# EAGLE design Laser_Teensy_proto (EAGLE 9.6.2)

## Sheet 1 of 3
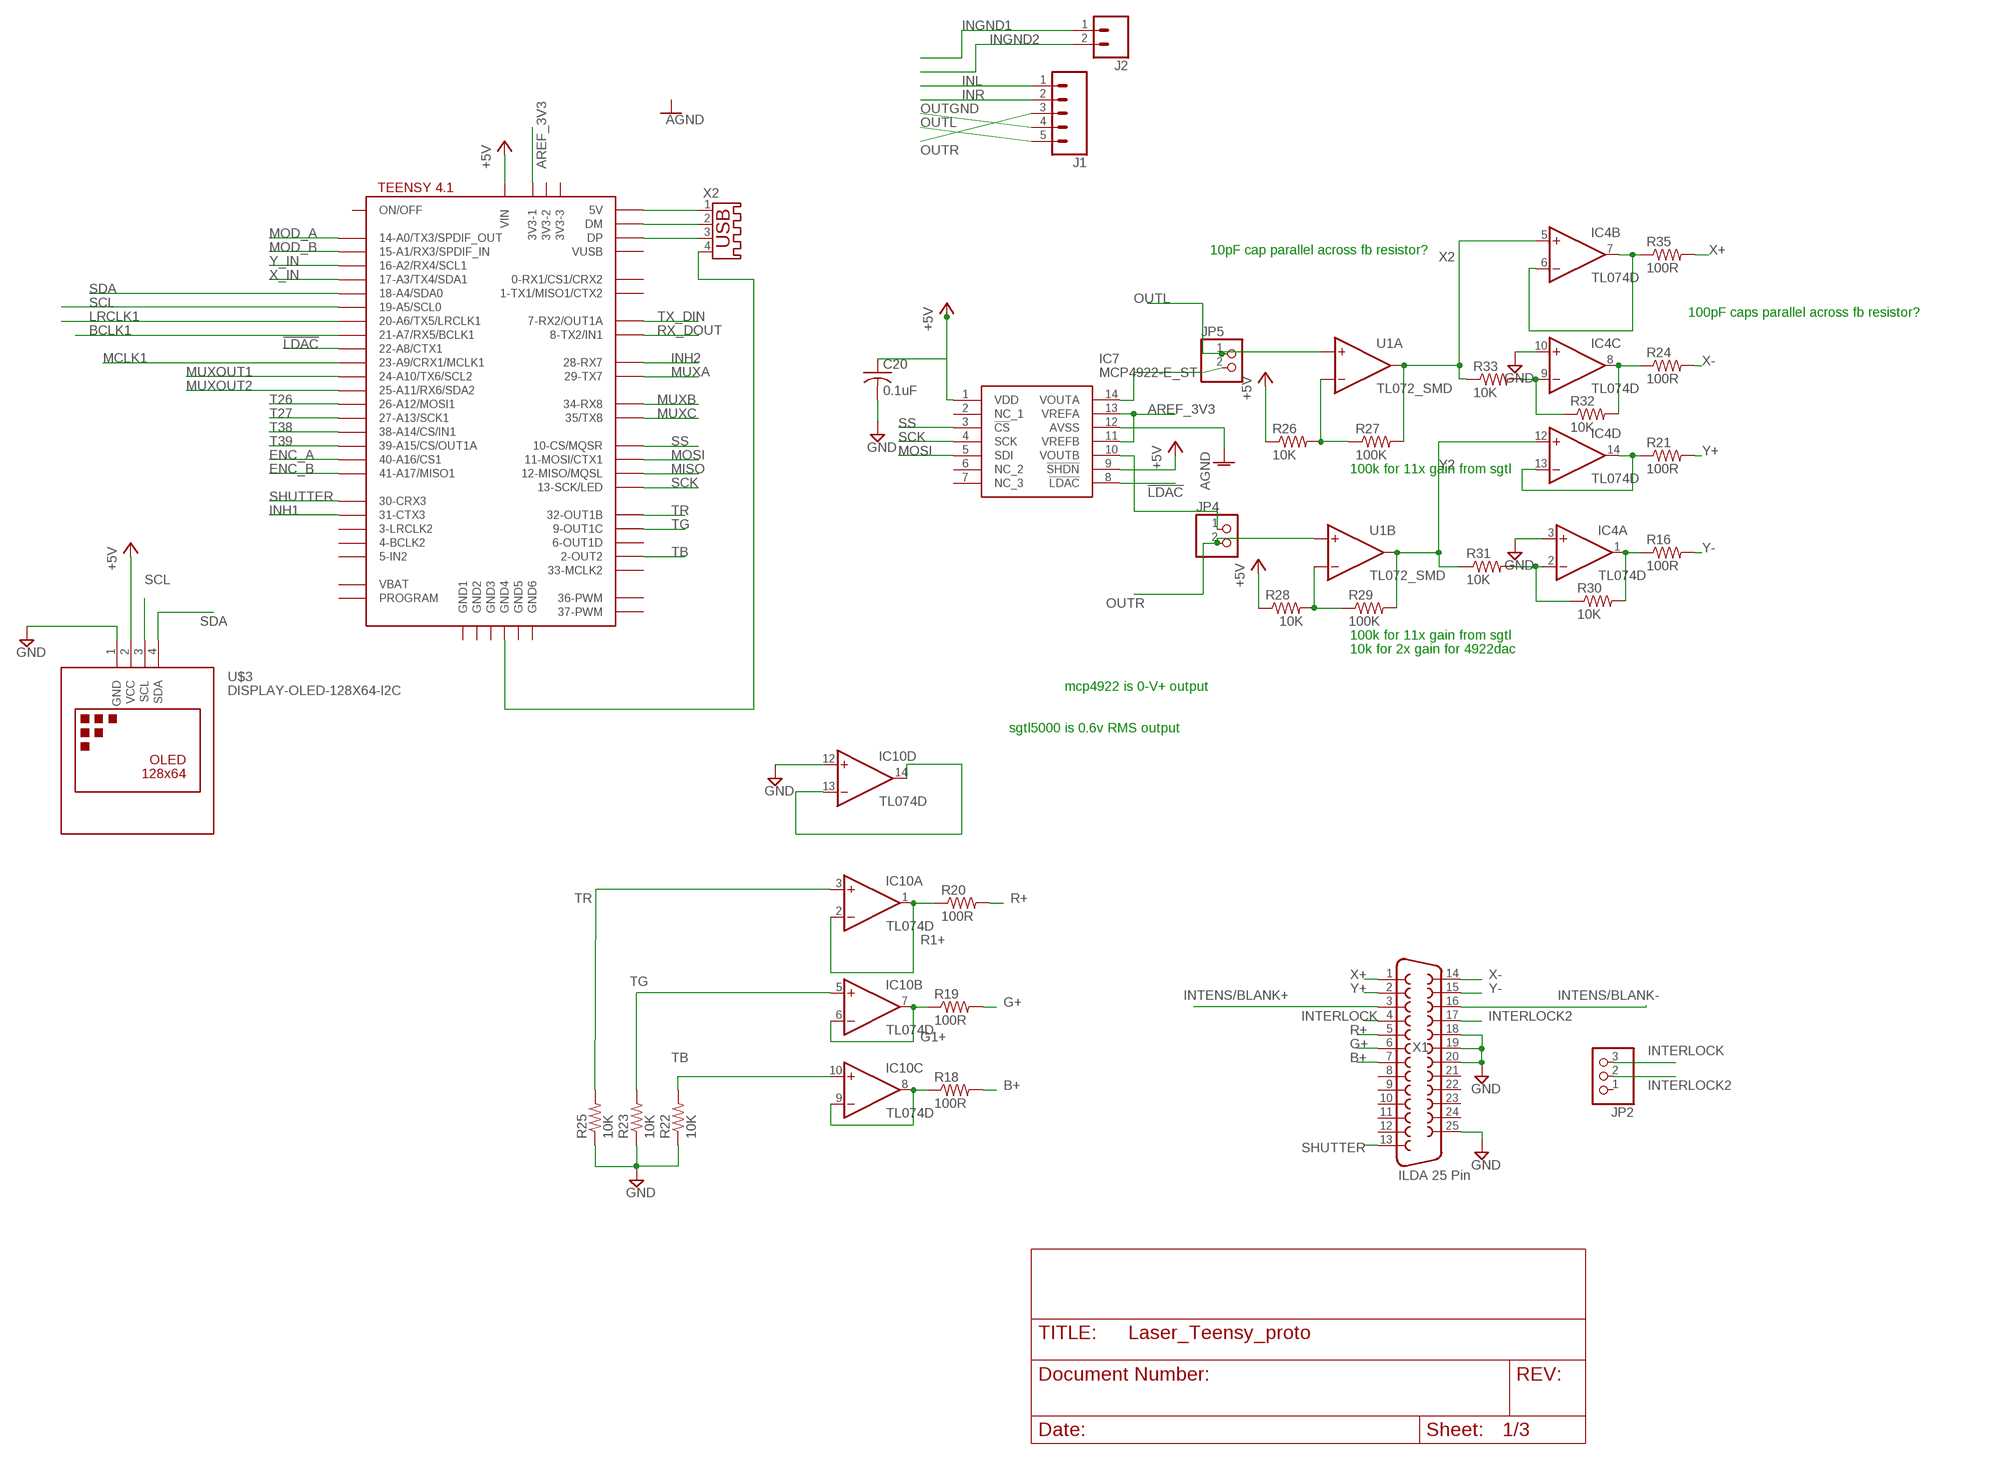
[diagram p0: schematic, sheet 1]

### Parts
C20  0.1uF  C-USC0603  [C0603]
IC4  TL074D  [SO14]
IC7  MCP4922-E_ST  [SOP65P638X110-14N]
IC10  TL074D  [SO14]
J1  CONN_05  [1X05]
J2  CONN_02  [1X02]
JP2  PINHD-1X3  [1X03]
JP4  PINHD-1X2  [1X02]
JP5  PINHD-1X2  [1X02]
R16  100R  R-US_0204/5  [0204/5]
R18  100R  R-US_0204/5  [0204/5]
R19  100R  R-US_0204/5  [0204/5]
R20  100R  R-US_0204/5  [0204/5]
R21  100R  R-US_0204/5  [0204/5]
R22  10K  R-US_0204/5  [0204/5]
R23  10K  R-US_0204/5  [0204/5]
R24  100R  R-US_0204/5  [0204/5]
R25  10K  R-US_0204/5  [0204/5]
R26  10K  R-US_0204/5  [0204/5]
R27  100K  R-US_0204/5  [0204/5]
R28  10K  R-US_0204/5  [0204/5]
R29  100K  R-US_0204/5  [0204/5]
R30  10K  R-US_0204/5  [0204/5]
R31  10K  R-US_0204/5  [0204/5]
R32  10K  R-US_R0603  [R0603]
R33  10K  R-US_0204/5  [0204/5]
R35  100R  R-US_0204/5  [0204/5]
U1  TL072_SMD  [SO08]
U$2  TEENSY41-E  [TENNSY41-E]
U$3  DISPLAY-OLED-128X64-I2C  [DISPLAY-OLED-128X64-I2C]
X1  ILDA 25 Pin  F25D  [F25D]
X2  USB-A003  [USB-A003]

### Nets
!LDAC: IC7.8(!LDAC) U$2.22-A8/CTX1
+5V [power]: C20.1 IC7.1(VDD) IC7.9(!SHDN) R26.1 R28.1 U$2.VIN U$3.2(VCC) ; also sheet 2,3
AGND: IC7.12(AVSS)
AREF_3V3: IC7.11(VREFB) IC7.13(VREFA) U$2.3V3-1
B1+1: IC10.8(C:OUT) IC10.9(C:-IN) R18.1
B+: R18.2 X1.7
BCLK1: U$2.21-A7/RX5/BCLK1
ENC_A: U$2.40-A16/CS1 ; also sheet 2
ENC_B: U$2.41-A17/MISO1 ; also sheet 2
G1+: IC10.6(B:-IN) IC10.7(B:OUT) R19.1
G+: R19.2 X1.6
GND: C20.2 IC4.3(A:+IN) IC4.10(C:+IN) IC10.12(D:+IN) R22.1 R23.1 R25.1 U$3.1(GND) X1.18 X1.19 X1.20 X1.25 ; also sheet 2,3
INGND1: J2.1
INGND2: J2.2
INH1: U$2.31-CTX3 ; also sheet 2
INH2: U$2.28-RX7 ; also sheet 2
INL: J1.1
INR: J1.2
INTENS/BLANK+: X1.3
INTENS/BLANK-: X1.16
INTERLOCK: JP2.3 X1.4
INTERLOCK2: JP2.2 X1.17
LRCLK1: U$2.20-A6/TX5/LRCLK1
MCLK1: U$2.23-A9/CRX1/MCLK1
MISO: U$2.12-MISO/MQSL
MOD_A: U$2.14-A0/TX3/SPDIF_OUT ; also sheet 2
MOD_B: U$2.15-A1/RX3/SPDIF_IN ; also sheet 2
MOSI: IC7.5(SDI) U$2.11-MOSI/CTX1
MUXA: U$2.29-TX7 ; also sheet 2
MUXB: U$2.34-RX8 ; also sheet 2
MUXC: U$2.35-TX8(35/TX8) ; also sheet 2
MUXOUT1: U$2.24-A10/TX6/SCL2 ; also sheet 2
MUXOUT2: U$2.25-A11/RX6/SDA2 ; also sheet 2
N$1: IC7.14(VOUTA) JP5.2
N$3: U$2.+5V(5V) X2.1
N$4: U$2.DM X2.2
N$5: U$2.DP X2.3
N$12: U$2.GND4 X2.4
N$13: IC10.13(D:-IN) IC10.14(D:OUT)
N$17: IC7.10(VOUTB) JP4.1
N$30: R26.2 R27.1 U1.2(A:-IN)
N$31: R28.2 R29.1 U1.6(B:-IN)
N$35: IC4.9(C:-IN) R32.1 R33.2
N$36: IC4.2(A:-IN) R30.1 R31.2
OUTGND: J1.4
OUTL: J1.5 JP5.1 U1.3(A:+IN)
OUTR: J1.3 JP4.2 U1.5(B:+IN)
R1+: IC10.1(A:OUT) IC10.2(A:-IN) R20.1
R+: R20.2 X1.5
RX_DOUT: U$2.8-TX2/IN1
SCK: IC7.4(SCK) U$2.13-SCK/LED
SCL: U$2.19-A5/SCL0 U$3.3(SCL)
SDA: U$2.18-A4/SDA0 U$3.4(SDA)
SHUTTER: U$2.30-CRX3 X1.13
SS: IC7.3(!CS) U$2.10-CS\MQSR(10-CS/MQSR)
T26: U$2.26-A12/MOSI1 ; also sheet 2
T27: U$2.27-A13/SCK1 ; also sheet 2
T38: U$2.38-A14/CS/IN1 ; also sheet 2
T39: U$2.39-A15/CS/OUT1A
TB: IC10.10(C:+IN) R22.2 U$2.2-OUT2
TG: IC10.5(B:+IN) R23.2 U$2.9-OUT1C
TR: IC10.3(A:+IN) R25.2 U$2.32-OUT1B
TX_DIN: U$2.7-RX2/OUT1A
X1+: IC4.6(B:-IN) IC4.7(B:OUT) R35.1
X1-: IC4.8(C:OUT) R24.1 R32.2
X2: IC4.5(B:+IN) R27.2 R33.1 U1.1(A:OUT)
X+: R35.2 X1.1
X-: R24.2 X1.14
X_IN: U$2.17-A3/TX4/SDA1 ; also sheet 2
Y1+: IC4.13(D:-IN) IC4.14(D:OUT) R21.1
Y1-: IC4.1(A:OUT) R16.1 R30.2
Y2: IC4.12(D:+IN) R29.2 R31.1 U1.7(B:OUT)
Y+: R21.2 X1.2
Y-: R16.2 X1.15
Y_IN: U$2.16-A2/RX4/SCL1 ; also sheet 2
Unconnected: IC7.2(NC_1) IC7.6(NC_2) IC7.7(NC_3) JP2.1 U$2.0-RX1/CS1/CRX2 U$2.1-TX1/MISO1/CTX2 U$2.3-LRCLK2 U$2.3V3-2 U$2.3V3-3 U$2.4-BCLK2 U$2.5-IN2 U$2.6-OUT1D U$2.33-MCLK2 U$2.36-PWM U$2.37-PWM U$2.GND1 U$2.GND2 U$2.GND3 U$2.GND5 U$2.GND6 U$2.ON/OFF U$2.PROGRAM U$2.VBAT U$2.VUSB X1.8 X1.9 X1.10 X1.11 X1.12 X1.21 X1.22 X1.23 X1.24

### Notes on the sheet
- 10pF cap parallel across fb resistor?
- 100pF caps parallel across fb resistor?
- 100k for 11x gain from sgtl
- 100k for 11x gain from sgtl
- 10k for 2x gain for 4922dac
- mcp4922 is 0-V+ output
- sgtl5000 is 0.6v RMS output

## Sheet 2 of 3
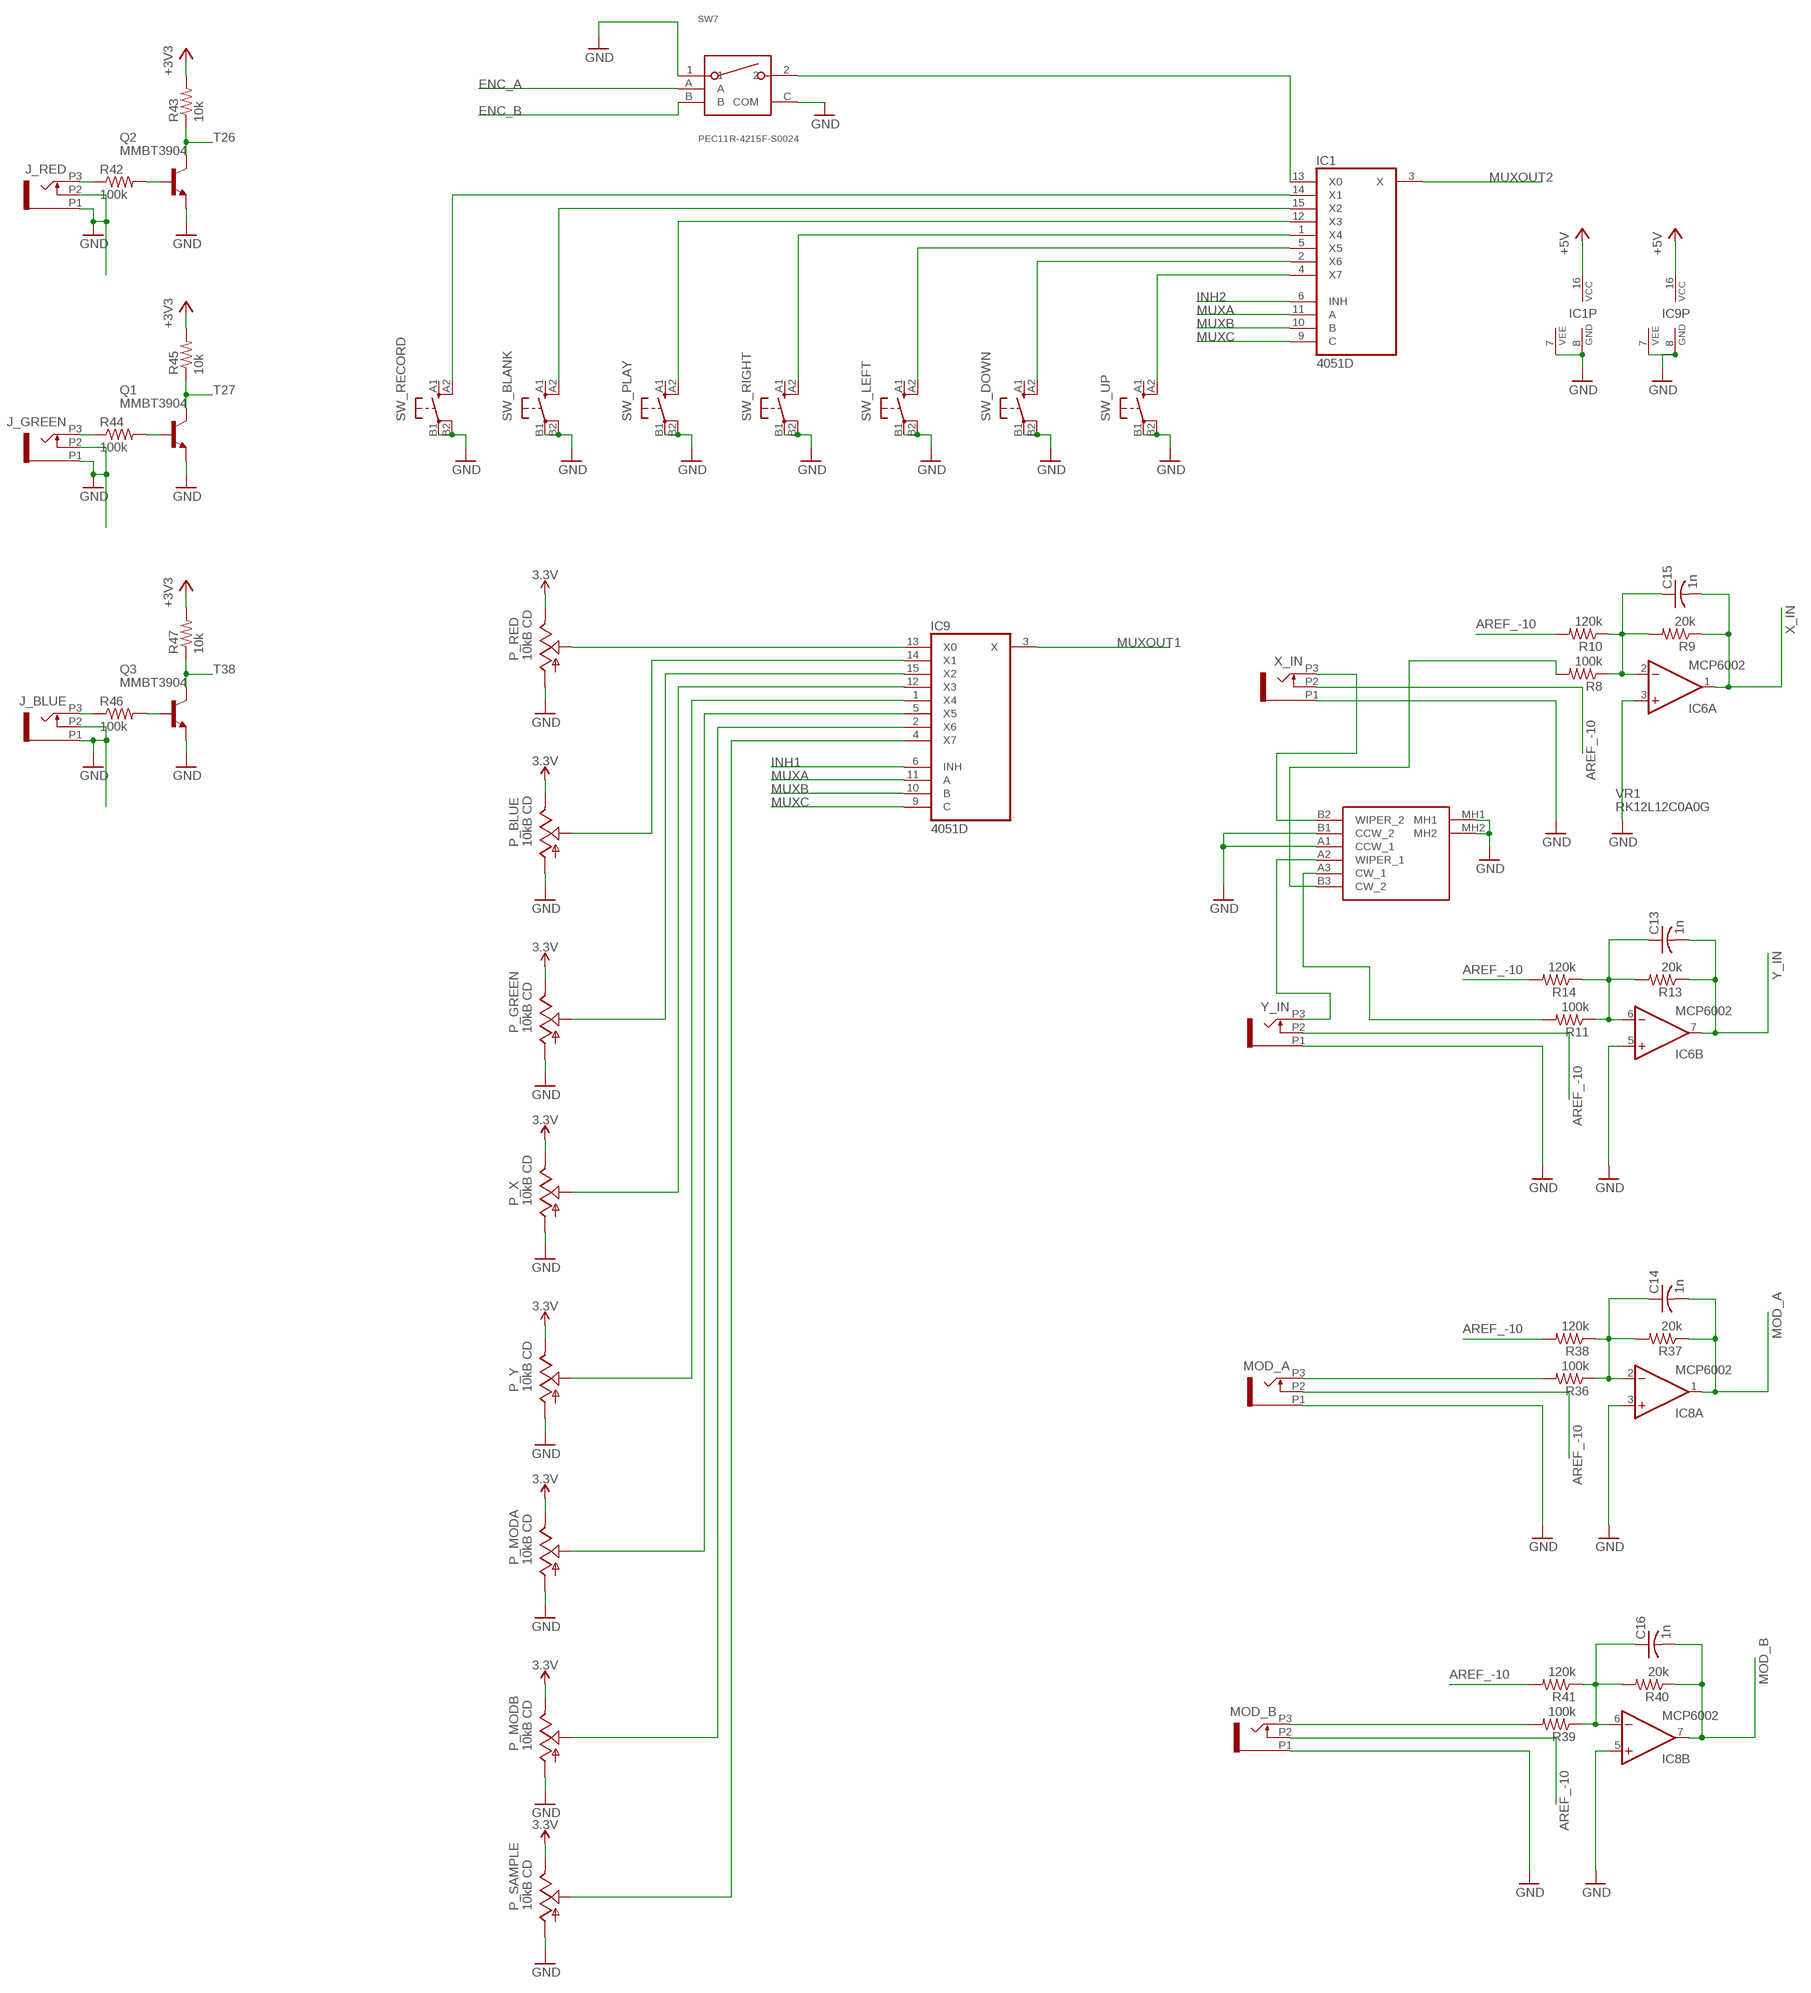
[diagram p1: schematic, sheet 2]

### Parts
C13  1n  C-US050-025X075  [C050-025X075]
C14  1n  C-US050-025X075  [C050-025X075]
C15  1n  C-US050-025X075  [C050-025X075]
C16  1n  C-US050-025X075  [C050-025X075]
IC1  4051D  [SO16]
IC6  MCP6002  TL072D  [SO08]
IC8  MCP6002  TL072D  [SO08]
IC9  4051D  [SO16]
J_BLUE  PJ301_THONKICONN6  [WQP_PJ_301M6]
J_GREEN  PJ301_THONKICONN6  [WQP_PJ_301M6]
J_RED  PJ301_THONKICONN6  [WQP_PJ_301M6]
MOD_A  PJ301_THONKICONN6  [WQP_PJ_301M6]
MOD_B  PJ301_THONKICONN6  [WQP_PJ_301M6]
P_BLUE  10kB CD  POT_USVERTICAL_PS  [ALPS_POT_VERTICAL_PS]
P_GREEN  10kB CD  POT_USVERTICAL_PS  [ALPS_POT_VERTICAL_PS]
P_MODA  10kB CD  POT_USVERTICAL_PS  [ALPS_POT_VERTICAL_PS]
P_MODB  10kB CD  POT_USVERTICAL_PS  [ALPS_POT_VERTICAL_PS]
P_RED  10kB CD  POT_USVERTICAL_PS  [ALPS_POT_VERTICAL_PS]
P_SAMPLE  10kB CD  POT_USVERTICAL_PS  [ALPS_POT_VERTICAL_PS]
P_X  10kB CD  POT_USVERTICAL_PS  [ALPS_POT_VERTICAL_PS]
P_Y  10kB CD  POT_USVERTICAL_PS  [ALPS_POT_VERTICAL_PS]
Q1  MMBT3904  MMBT3904LT1-NPN-SOT23-BEC  [SOT23-BEC]
Q2  MMBT3904  MMBT3904LT1-NPN-SOT23-BEC  [SOT23-BEC]
Q3  MMBT3904  MMBT3904LT1-NPN-SOT23-BEC  [SOT23-BEC]
R8  100k  R-US_0204/5  [0204/5]
R9  20k  R-US_0204/5  [0204/5]
R10  120k  R-US_0204/5  [0204/5]
R11  100k  R-US_0204/5  [0204/5]
R13  20k  R-US_0204/5  [0204/5]
R14  120k  R-US_0204/5  [0204/5]
R36  100k  R-US_0204/5  [0204/5]
R37  20k  R-US_0204/5  [0204/5]
R38  120k  R-US_0204/5  [0204/5]
R39  100k  R-US_0204/5  [0204/5]
R40  20k  R-US_0204/5  [0204/5]
R41  120k  R-US_0204/5  [0204/5]
R42  100k  R-US_0204/5  [0204/5]
R43  10k  R-US_0204/5  [0204/5]
R44  100k  R-US_0204/5  [0204/5]
R45  10k  R-US_0204/5  [0204/5]
R46  100k  R-US_0204/5  [0204/5]
R47  10k  R-US_0204/5  [0204/5]
SW7  PEC11R-4215F-S0024  [PEC11R-4215F-S0024]
SW_BLANK  D6R  [D6R]
SW_DOWN  D6R  [D6R]
SW_LEFT  D6R  [D6R]
SW_PLAY  D6R  [D6R]
SW_RECORD  D6R  [D6R]
SW_RIGHT  D6R  [D6R]
SW_UP  D6R  [D6R]
VR1  RK12L12C0A0G  [RK12L12C0A0G]
X_IN  PJ301_THONKICONN6  [WQP_PJ_301M6]
Y_IN  PJ301_THONKICONN6  [WQP_PJ_301M6]

### Nets
3.3V [+3V3]: P_BLUE.P$1(E) P_GREEN.P$1(E) P_MODA.P$1(E) P_MODB.P$1(E) P_RED.P$1(E) P_SAMPLE.P$1(E) P_X.P$1(E) P_Y.P$1(E)
+3V3: R43.2 R45.2 R47.2 ; also sheet 3
+5V [power]: IC1.16(VCC) IC9.16(VCC) ; also sheet 1,3
AREF_-10 [-10V]: MOD_A.P2 MOD_B.P2 R10.2 R14.2 R38.2 R41.2 X_IN.P2 Y_IN.P2 ; also sheet 3
ENC_A: SW7.A ; also sheet 1
ENC_B: SW7.B ; also sheet 1
GND: IC1.7(VEE) IC1.8(GND) IC6.3(A:+IN) IC6.5(B:+IN) IC8.3(A:+IN) IC8.5(B:+IN) IC9.7(VEE) IC9.8(GND) J_BLUE.P1 J_BLUE.P2 J_GREEN.P1 J_GREEN.P2 J_RED.P1 J_RED.P2 MOD_A.P1 MOD_B.P1 P_BLUE.P$3(A) P_GREEN.P$3(A) P_MODA.P$3(A) P_MODB.P$3(A) P_RED.P$3(A) P_SAMPLE.P$3(A) P_X.P$3(A) P_Y.P$3(A) Q1.E Q2.E Q3.E SW7.1 SW7.C(COM) SW_BLANK.B1(P) SW_BLANK.B2(P1) SW_DOWN.B1(P) SW_DOWN.B2(P1) SW_LEFT.B1(P) SW_LEFT.B2(P1) SW_PLAY.B1(P) SW_PLAY.B2(P1) SW_RECORD.B1(P) SW_RECORD.B2(P1) SW_RIGHT.B1(P) SW_RIGHT.B2(P1) SW_UP.B1(P) SW_UP.B2(P1) VR1.A1(CCW_1) VR1.B1(CCW_2) VR1.MH1 VR1.MH2 X_IN.P1 Y_IN.P1 ; also sheet 1,3
INH1: IC9.6(INH) ; also sheet 1
INH2: IC1.6(INH) ; also sheet 1
MOD_A: C14.2 IC8.1(A:OUT) R37.1 ; also sheet 1
MOD_B: C16.2 IC8.7(B:OUT) R40.1 ; also sheet 1
MUXA: IC1.11(A) IC9.11(A) ; also sheet 1
MUXB: IC1.10(B) IC9.10(B) ; also sheet 1
MUXC: IC1.9(C) IC9.9(C) ; also sheet 1
MUXOUT1: IC9.3(X) ; also sheet 1
MUXOUT2: IC1.3(X) ; also sheet 1
N$6: C15.1 IC6.2(A:-IN) R8.1 R9.2 R10.1
N$9: VR1.B2(WIPER_2) X_IN.P3
N$11: C13.1 IC6.6(B:-IN) R11.1 R13.2 R14.1
N$14: C14.1 IC8.2(A:-IN) R36.1 R37.2 R38.1
N$15: R8.2 VR1.B3(CW_2)
N$19: IC1.14(X1) SW_RECORD.A2(S1)
N$20: IC1.15(X2) SW_BLANK.A2(S1)
N$21: IC1.12(X3) SW_PLAY.A2(S1)
N$22: IC9.13(X0) P_RED.P$2(S)
N$23: IC1.1(X4) SW_RIGHT.A2(S1)
N$24: IC9.14(X1) P_BLUE.P$2(S)
N$25: VR1.A2(WIPER_1) Y_IN.P3
N$26: IC1.5(X5) SW_LEFT.A2(S1)
N$27: IC9.15(X2) P_GREEN.P$2(S)
N$28: IC1.2(X6) SW_DOWN.A2(S1)
N$29: IC9.12(X3) P_X.P$2(S)
N$32: IC9.1(X4) P_Y.P$2(S)
N$33: IC1.4(X7) SW_UP.A2(S1)
N$34: C16.1 IC8.6(B:-IN) R39.1 R40.2 R41.1
N$39: IC1.13(X0) SW7.2
N$40: IC9.5(X5) P_MODA.P$2(S)
N$41: IC9.2(X6) P_MODB.P$2(S)
N$42: IC9.4(X7) P_SAMPLE.P$2(S)
N$43: R11.2 VR1.A3(CW_1)
N$44: J_RED.P3 R42.1
N$45: MOD_A.P3 R36.2
N$46: MOD_B.P3 R39.2
N$48: Q1.B R44.2
N$49: J_GREEN.P3 R44.1
N$51: Q3.B R46.2
N$52: J_BLUE.P3 R46.1
N$66: Q2.B R42.2
T26: Q2.C R43.1 ; also sheet 1
T27: Q1.C R45.1 ; also sheet 1
T38: Q3.C R47.1 ; also sheet 1
X_IN: C15.2 IC6.1(A:OUT) R9.1 ; also sheet 1
Y_IN: C13.2 IC6.7(B:OUT) R13.1 ; also sheet 1
Unconnected: SW_BLANK.A1(S) SW_DOWN.A1(S) SW_LEFT.A1(S) SW_PLAY.A1(S) SW_RECORD.A1(S) SW_RIGHT.A1(S) SW_UP.A1(S)

## Sheet 3 of 3
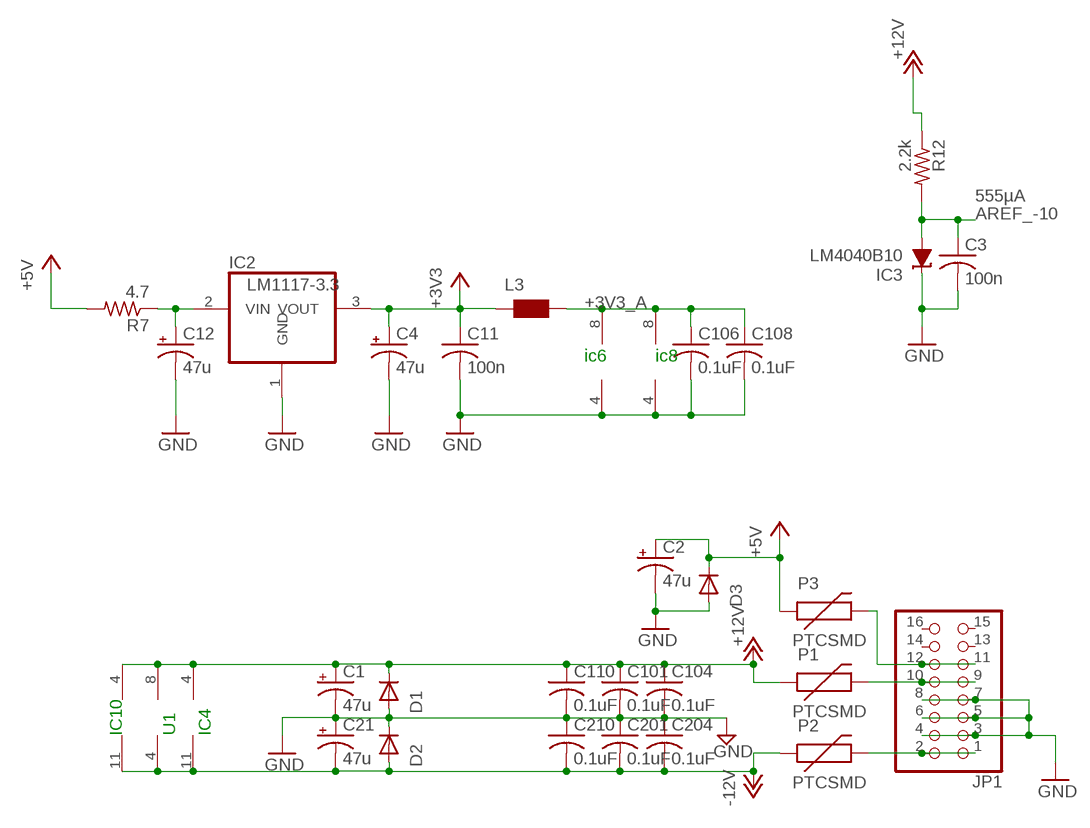
[diagram p2: schematic, sheet 3]

### Parts
C1  47u  CPOL-USE3.5-8  [E3,5-8]
C2  47u  CPOL-USE3.5-8  [E3,5-8]
C3  100n  C-USC0603  [C0603]
C4  47u  CPOL-USE3.5-8  [E3,5-8]
C11  100n  C-USC0603  [C0603]
C12  47u  CPOL-USE3.5-8  [E3,5-8]
C21  47u  CPOL-USE3.5-8  [E3,5-8]
C101  0.1uF  C-USC0603  [C0603]
C104  0.1uF  C-USC0603  [C0603]
C106  0.1uF  C-USC0603  [C0603]
C108  0.1uF  C-USC0603  [C0603]
C110  0.1uF  C-USC0603  [C0603]
C201  0.1uF  C-USC0603  [C0603]
C204  0.1uF  C-USC0603  [C0603]
C210  0.1uF  C-USC0603  [C0603]
D1  1N5819HW  DIODE-SOD123  [SOD123]
D2  1N5819HW  DIODE-SOD123  [SOD123]
D3  1N5819HW  DIODE-SOD123  [SOD123]
IC2  LM1117-3.3  REG1117T  [TO252]
IC3  LM4040B10  LM4041B12DBZ  [DBZ_R-PDSO-G3]
JP1  PINHD-2X8  [2X08]
L3  WE-CBF_0603  [0603]
P1  PTCSMD  [PTC-1206]
P2  PTCSMD  [PTC-1206]
P3  PTCSMD  [PTC-1206]
R7  4.7  R-US_R1206  [R1206]
R12  2.2k  R-US_0204/5  [0204/5]

### Nets
+3V3: C4.+ C11.1 IC2.3(VOUT) L3.1 ; also sheet 2
+3V3_A: C106.1 C108.1 IC6.8(P:V+) IC8.8(P:V+) L3.2
+5V [power]: C2.+ D3.C P3.1 R7.2 ; also sheet 1,2
+12V [power]: C1.+ C101.1 C104.1 C110.1 D1.C IC4.4(P:V+) IC10.4(P:V+) P1.1 R12.1 U1.8(P:V+)
-12V [power]: C21.- C201.2 C204.2 C210.2 D2.A IC4.11(P:V-) IC10.11(P:V-) P2.1 U1.4(P:V-)
AREF_-10 [-10V]: C3.1 IC3.2(A) R12.2 ; also sheet 2
GND: C1.- C2.- C3.2 C4.- C11.2 C12.- C21.+ C101.2 C104.2 C106.2 C108.2 C110.2 C201.1 C204.1 C210.1 D1.A D2.C D3.A IC2.1(GND) IC3.1(C) IC6.4(P:V-) IC8.4(P:V-) JP1.3 JP1.4 JP1.5 JP1.6 JP1.7 JP1.8 ; also sheet 1,2
N$7: JP1.1 JP1.2 P2.2
N$8: JP1.9 JP1.10 P1.2
N$10: JP1.11 JP1.12 P3.2
N$16: C12.+ IC2.2(VIN) R7.1
Unconnected: JP1.13 JP1.14 JP1.15 JP1.16

### Notes on the sheet
- 555µA
- ic6 | ic8
- IC10 | U1 | IC4

## Library data of the parts
C1 C2 C4 C12 C21 = rcl:CPOL-US: POLARIZED CAPACITOR, American symbol; SPICEPREFIX: C
C3 C11 = rcl:C-US: CAPACITOR, American symbol
C13-C16 = rcl:C-US: CAPACITOR, American symbol; SPICEPREFIX: C
C20 C101 C104 C106 C108 C110 C201 C204 C210 = adafruit:C-US: CAPACITOR, American symbol
D1-D3 = diode:DIODE-: DIODE
IC1 IC9 = 40xx:4051: 8-channel ANALOG MULTIPLEXER
IC2 = og-vreg:REG1117: 800mA and 1A Low Dropout (LDO) Positive Regulator 1.8V, 2.5V, 2.85V, 3.3V, 5V, and Adj
IC3 = texas:LM4041: PRECISION MICROPOWER SHUNT VOLTAGE REFERENCE Source: http://focus.ti.com/lit/ds/slcs146e/slcs146e.pdf
IC4 IC10 = linear:TL074: OP AMP
IC6 IC8 = linear:TL072: OP AMP
IC7 = SamacSys_Parts:MCP4922-E_ST: Microchip MCP4922-E/ST, 2-channel 12 bit Serial DAC, 14-Pin TSSOP Source: Datasheet <http://componentsearchengine.com/Datasheets/3/MCP4922-E_ST.pdf>; ARROW_PART_NUMBER: MCP4922-E/ST; ARROW_PRICE-STOCK: https://www.arrow.com/en/products/mcp4922-est/microchip-technology; DESCRIPTION: Microchip MCP4922-E/ST, 2-channel 12 bit Serial DAC, 14-Pin TSSOP; HEIGHT: 1.1mm; MANUFACTURER_NAME: Microchip; MANUFACTURER_PART_NUMBER: MCP4922-E/ST; MOUSER_PART_NUMBER: 579-MCP4922-E/ST; MOUSER_PRICE-STOCK: https://www.mouser.co.uk/ProductDetail/Microchip-Technology/MCP4922-E-ST?qs=iRhCjdSJZe6gRerFwLixKQ%3D%3D
J1 = SparkFun-Connectors:CONN_05: Multi connection point. Often used as Generic Header-pin footprint for 0.1 inch spaced/style header connections On any of the 0.1 inch spaced packages, you can populate with these: Break Away Headers - Straight <https://www.sparkfun.com/products/116> (PRT-00116) Break Away Male Headers - Right Angle <https://www.sparkfun.com/products/553> (PRT-00553) Female Headers <https://www.sparkfun.com/products/115> (PRT-00115) Break Away Headers - Machine Pin <https://www.sparkfun.com/products/117> (PRT-00117) Break Away Female Headers - Swiss Machine Pin <https://www.sparkfun.com/products/743> (PRT-00743) For SCREWTERMINALS and SPRING TERMINALS visit here: Screw Terimnals on SparkFun.com <https://www.sparkfun.com/search/results?term=Screw+Terminals> (5mm/3.5mm/2.54mm spacing) This device is also useful as a general connection point to wire up your design to another part of your project. Our various solder wires solder well into these plated through hole pads. Hook-Up Wire - Assortment (Stranded, 22 AWG) <https://www.sparkfun.com/products/11375> (PRT-11375) Hook-Up Wire - Assortment (Solid Core, 22 AWG) <https://www.sparkfun.com/products/11367> (PRT-11367) View the entire wire category on our website here <https://www.sparkfun.com/categories/141> Special notes: Molex polarized connector foot print use with SKU : PRT-08231 with associated crimp pins and housings. 1MM SMD Version SKU: PRT-10208
J2 = SparkFun-Connectors:CONN_02: Multi connection point. Often used as Generic Header-pin footprint for 0.1 inch spaced/style header connections On any of the 0.1 inch spaced packages, you can populate with these: Break Away Headers - Straight <https://www.sparkfun.com/products/116> (PRT-00116) Break Away Male Headers - Right Angle <https://www.sparkfun.com/products/553> (PRT-00553) Female Headers <https://www.sparkfun.com/products/115> (PRT-00115) Break Away Headers - Machine Pin <https://www.sparkfun.com/products/117> (PRT-00117) Break Away Female Headers - Swiss Machine Pin <https://www.sparkfun.com/products/743> (PRT-00743) For SCREWTERMINALS and SPRING TERMINALS visit here: Screw Terimnals on SparkFun.com <https://www.sparkfun.com/search/results?term=Screw+Terminals> (5mm/3.5mm/2.54mm spacing) This device is also useful as a general connection point to wire up your design to another part of your project. Our various solder wires solder well into these plated through hole pads. Hook-Up Wire - Assortment (Stranded, 22 AWG) <https://www.sparkfun.com/products/11375> (PRT-11375) Hook-Up Wire - Assortment (Solid Core, 22 AWG) <https://www.sparkfun.com/products/11367> (PRT-11367) View the entire wire category on our website here <https://www.sparkfun.com/categories/141> Special notes: Molex polarized connector foot print use with: PRT-08233 with associated crimp pins and housings. 2.54_SCREWTERM for use with PRT-10571. 3.5mm Screw Terminal footprints for PRT-08084 5mm Screw Terminal footprints for use with PRT-08432
J_BLUE J_GREEN J_RED = og-pj301:PJ301_THONKICONN
JP1 = pinhead:PINHD-2X8: PIN HEADER
JP2 = pinhead:PINHD-1X3: PIN HEADER
JP4 JP5 = pinhead:PINHD-1X2: PIN HEADER
L3 = wuerth-elektronik:WE-CBF: SMD EMI Suppression Ferrite Beads - excellent anti-EMI properties - low DCR - impedances till 3000 ohms - rated current up to 6 A
MOD_A MOD_B X_IN Y_IN = og-pj301_variations:PJ301_THONKICONN
P1-P3 = SparkFun:PTC: Resettable Fuse PTC Resettable Fuse. Spark Fun Electronics SKU : COM-08357
P_BLUE P_GREEN P_MODA P_MODB P_RED P_SAMPLE P_X P_Y = pot-alps:POT_US
Q1-Q3 = transistor:*-NPN-: NPN Transistror BF959 corrected 2008.03.06
R7 = rcl:R-US_: RESISTOR, American symbol
R8-R14 R16 R18-R31 R33 R35-R47 = rcl:R-US_: RESISTOR, American symbol; SPICEPREFIX: R
R32 = resistor:R-US_: RESISTOR, American symbol
SW7 = Switch:PEC11R-4215F-S0024: ROTARY ENCODER MECHANICAL 24PPR Manufacturer's datasheet <https://www.bourns.com/docs/Product-Datasheets/PEC11R.pdf>; CREATED_BY: PCBLayout.com; DIGIKEY_PART_NUMBER: PEC11R-4215F-S0024-ND; MANUFACTURER: Bourns Inc.; MPN: PEC11R-4215F-S0024
SW_BLANK SW_DOWN SW_LEFT SW_PLAY SW_RECORD SW_RIGHT SW_UP = og-switch:D6R: C&K D6R
U1 = MusicThingModular:TL072: Generic Dual Op Amp
U$2 = teensy:TEENSY41-E
U$3 = diy-modules:DISPLAY-OLED-128X64-I2C: 128x64 Dot Matrix OLED Module based on SSD1306 chip Variant with I2C interface More details available here: http://www.instructables.com/id/Monochrome-096-i2c-OLED-display-with-arduino-SSD13/ SSD1306 datasheet: https://cdn-shop.adafruit.com/datasheets/SSD1306.pdf Click here to find device on ebay.com <http://www.ebay.com/sch/oled+display+128x64+iic> Note: There are two variants: I2C and SPI. Search for the proper version.
VR1 = SamacSys_Parts:RK12L12C0A0G: Alps Potentiometer RK12L Series with a 6 mm Dia. Shaft 10k +/-20%, Logarithmic, Through Hole Source: Datasheet <http://uk.rs-online.com/web/p/products/7293697P>; DESCRIPTION: Alps Potentiometer RK12L Series with a 6 mm Dia. Shaft 10k +/-20%, Logarithmic, Through Hole; HEIGHT: 15mm; MANUFACTURER_NAME: ALPS; MANUFACTURER_PART_NUMBER: RK12L12C0A0G; MOUSER_PART_NUMBER: 688-RK12L12C0A0G; MOUSER_PRICE-STOCK: https://www.mouser.co.uk/ProductDetail/ALPS/RK12L12C0A0G?qs=haWY0xvQGj%2FMhz6JhOHy%252BQ%3D%3D
X1 = SparkFun:F25: D-SUB 25 25 Pin male connector. PCB edge mount for regular PCB thicknesses. This connector will connect directly to the back of a PC parallel port or through a normal DB25 extension cable (M/F). SKU: PRT-08287
X2 = con-yamaichi:USB-A003: USB connector; OC_FARNELL: unknown; OC_NEWARK: unknown

## Net classes
1 power: width 0.305 mm, clearance 0.203 mm
2 +3V3: width 0.356 mm, clearance 0.152 mm to class 0, clearance 0.254 mm
3 -10V: width 0.356 mm, clearance 0.152 mm to class 0, clearance 0.254 mm
4 VCC: width 0.457 mm, clearance 0.152 mm to class 0, clearance 0.254 mm

## Board
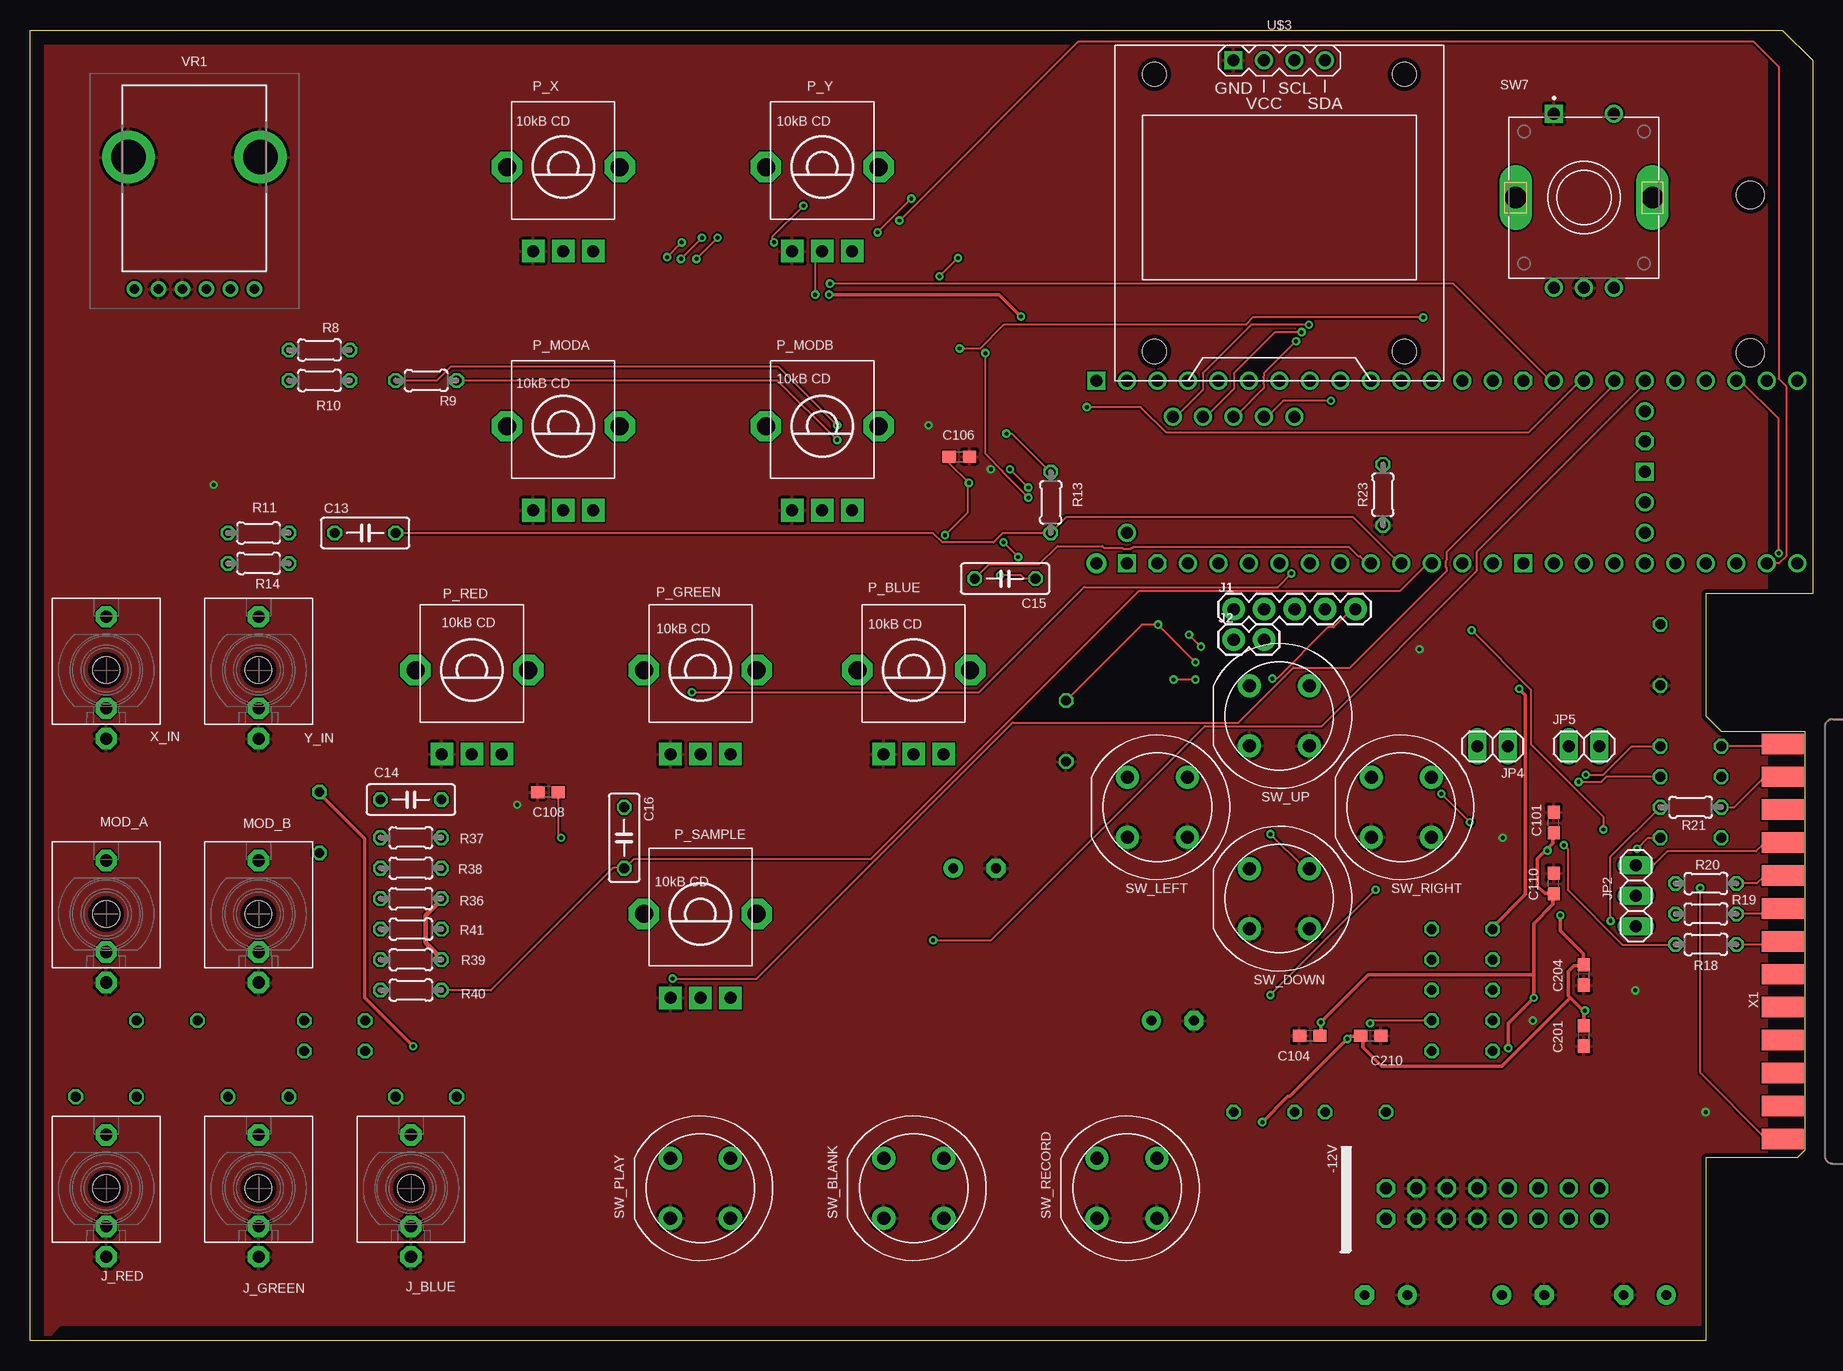
[diagram p3: board, top side]
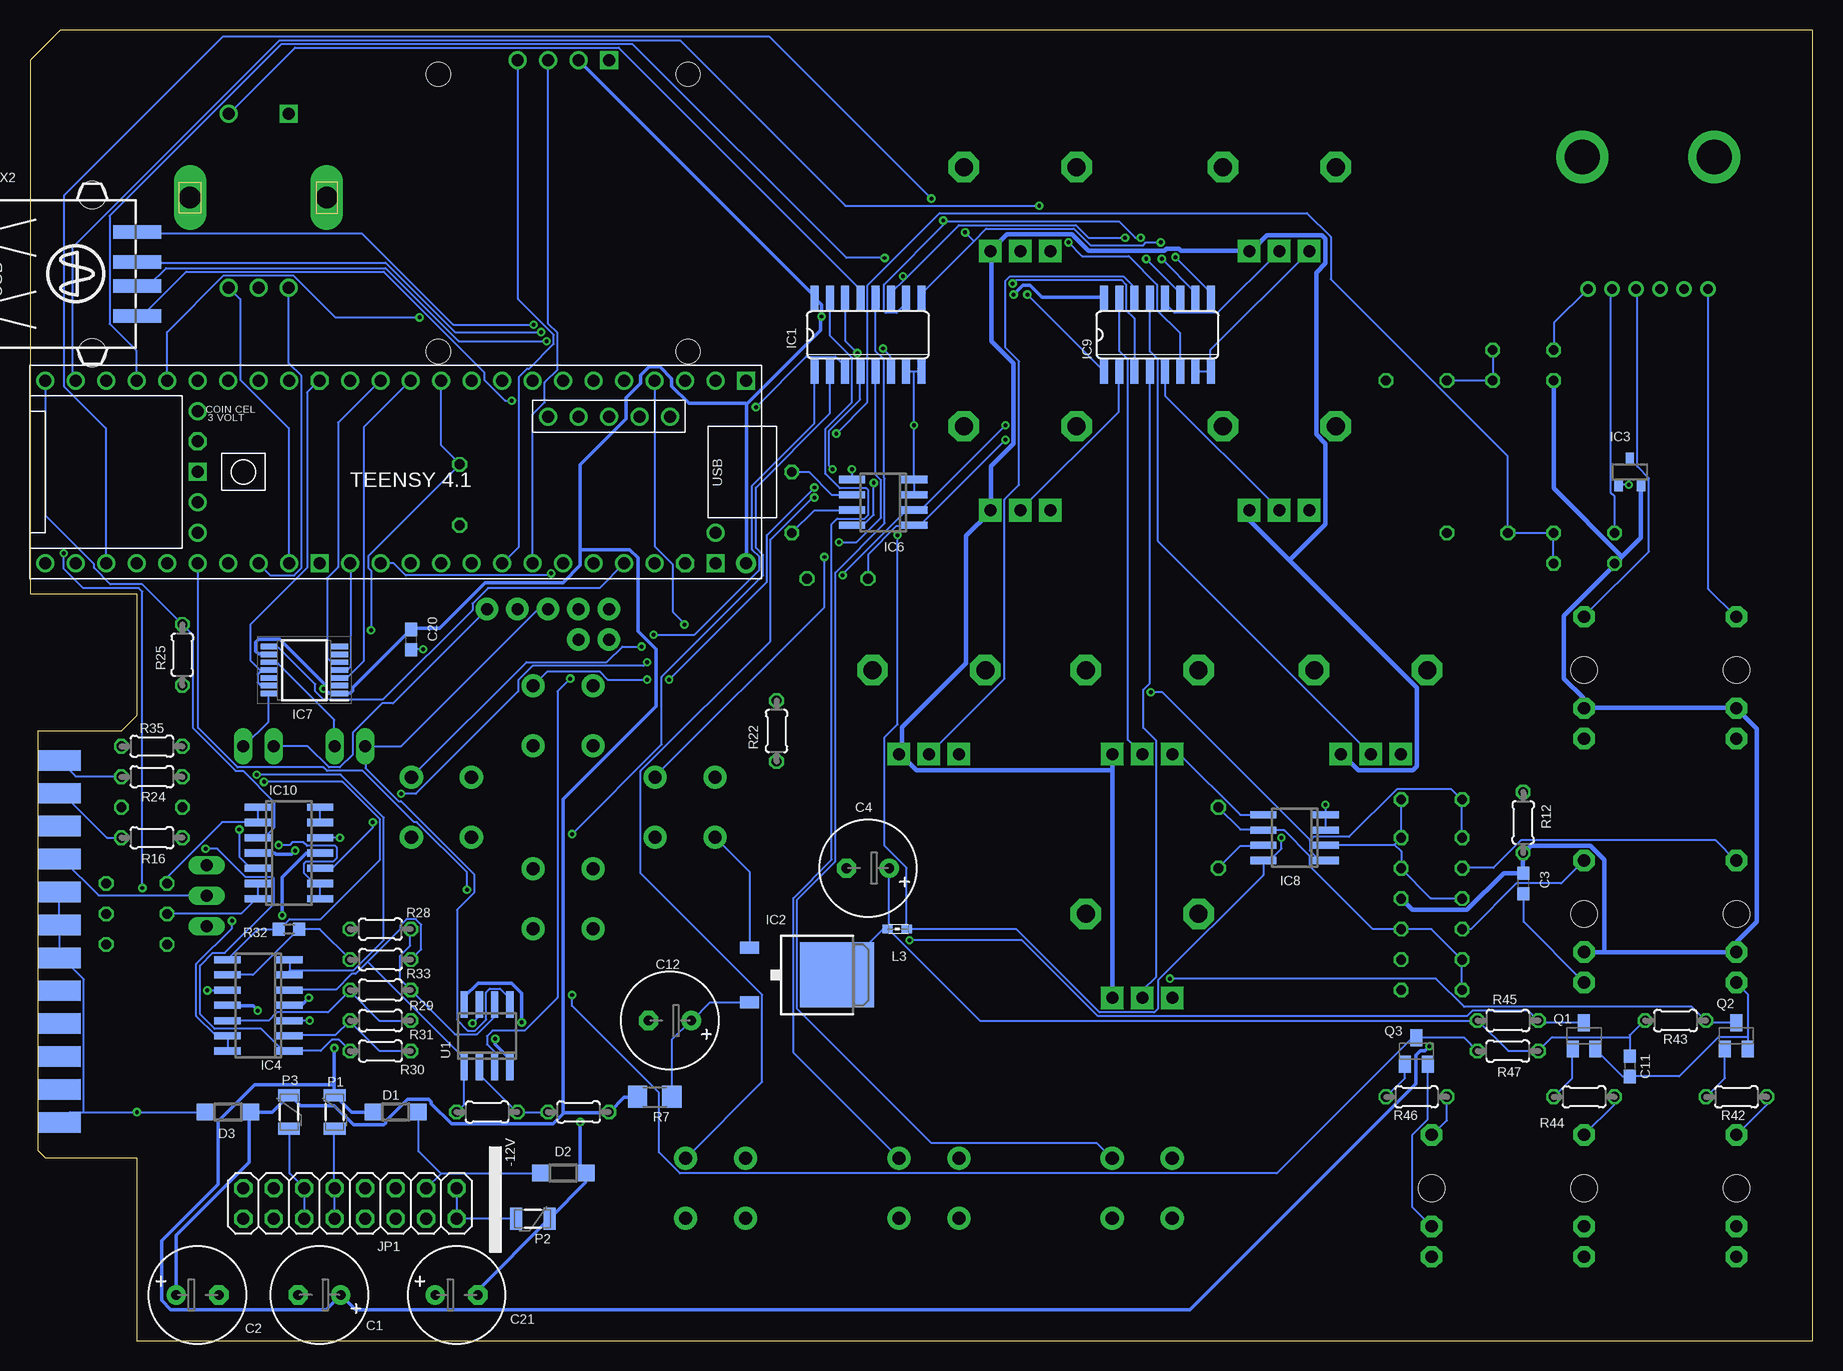
[diagram p4: board, bottom side, seen from below]

Size 148.59 x 109.22 mm. Coordinates in mm from the lower left corner, seen from the top.
Outline: 0,0 0,109.22 146.05,109.22 148.59,106.68 148.59,62.23 139.7,62.23 139.7,52.07 140.97,50.8 147.95,50.8 147.95,15.88 147.32,15.24 139.7,15.24 139.7,0 0,0
Copper layers (1*16): Top 0.0356mm / dielectric 1.5011mm / Bottom 0.0356mm
Design rules "LaenPCBOrder": minimum track width 6mil, minimum drill 13mil, track to track 6mil, track to pad 6mil, pad to pad 6mil, via to via 6mil, smd to smd 6mil, copper to edge 15mil, drill to drill 6mil, minimum pad ring 7mil, minimum via ring 7mil, stop-mask expansion 4mil, vias tented up to drill 0mil, thermal gap 10mil

### Footprints (pad centres in the part's own frame; a part is rotated, then mirrored left to right if it is on the bottom)
E3,5-8 = drill 0.813 pad 1.6: + -1.778,0 | drill 0.813 pad 1.6 octagon: - 1.778,0
C0603 = smd 1.1 x 1: 1 -0.85,0; 2 0.85,0
C050-025X075 = drill 0.813 octagon: 1 -2.54,0; 2 2.54,0
SOD123 = smd 1.4 x 1.4: A 1.9,0; C -1.9,0
SO16 = smd 0.66 x 2.032: 1 -4.445,-3.073; 2 -3.175,-3.073; 3 -1.905,-3.073; 4 -0.635,-3.073; 5 0.635,-3.073; 6 1.905,-3.073; 7 3.175,-3.073; 8 4.445,-3.073; 9 4.445,3.073; 10 3.175,3.073; 11 1.905,3.073; 12 0.635,3.073; 13 -0.635,3.073; 14 -1.905,3.073; 15 -3.175,3.073; 16 -4.445,3.073
TO252 = smd 1 x 1.6: 1 -2.28,-4.8; 2 2.28,-4.8 | smd 5.4 x 6.2: 3 0,2.5
DBZ_R-PDSO-G3 = smd 0.7 x 1: 1 -0.95,-1.1; 2 0.95,-1.1; 3 0,1.1
SO14 = smd 0.6 x 2.2: 1 -3.81,-2.6; 2 -2.54,-2.6; 3 -1.27,-2.6; 4 0,-2.6; 5 1.27,-2.6; 6 2.54,-2.6; 7 3.81,-2.6; 8 3.81,2.6; 9 2.54,2.6; 10 1.27,2.6; 11 0,2.6; 12 -1.27,2.6; 13 -2.54,2.6; 14 -3.81,2.6
SO08 = smd 0.6 x 2.2: 1 -1.905,-2.6; 2 -0.635,-2.6; 3 0.635,-2.6; 4 1.905,-2.6; 5 1.905,2.6; 6 0.635,2.6; 7 -0.635,2.6; 8 -1.905,2.6
SOP65P638X110-14N = smd 1.45 x 0.45: 1 -2.925,1.95; 2 -2.925,1.3; 3 -2.925,0.65; 4 -2.925,0; 5 -2.925,-0.65; 6 -2.925,-1.3; 7 -2.925,-1.95; 8 2.925,-1.95; 9 2.925,-1.3; 10 2.925,-0.65; 11 2.925,0; 12 2.925,0.65; 13 2.925,1.3; 14 2.925,1.95
1X05 = drill 1.016 pad 1.88: 1 0,0; 2 2.54,0; 3 5.08,0; 4 7.62,0; 5 10.16,0
1X02 = drill 1.016 pad 1.88: 1 0,0; 2 2.54,0
WQP_PJ_301M6 = drill 1.016 pad 1.778 octagon: P1 0,-5.715; P2 0,-3.175; P3 0,4.445 | hole 2.2: 0,0
2X08 = drill 1.016 octagon: 1 -8.89,-1.27; 2 -8.89,1.27; 3 -6.35,-1.27; 4 -6.35,1.27; 5 -3.81,-1.27; 6 -3.81,1.27; 7 -1.27,-1.27; 8 -1.27,1.27; 9 1.27,-1.27; 10 1.27,1.27; 11 3.81,-1.27; 12 3.81,1.27; 13 6.35,-1.27; 14 6.35,1.27; 15 8.89,-1.27; 16 8.89,1.27
1X03 = drill 1.016 long: 1 -2.54,0; 2 0,0; 3 2.54,0
1X02' = drill 1.016 long: 1 -1.27,0; 2 1.27,0
0603 = smd 0.85 x 0.7: 1 -0.9,0; 2 0.7,0
PTC-1206 = smd 1 x 1.8: 1 -1.4,0; 2 1.4,0
ALPS_POT_VERTICAL_PS = drill 1 pad 1.88 square: P$1 -2.5,7; P$2 0,7; P$3 2.5,7 | drill 1.5 pad 2.54 octagon: P$4 -4.7,0; P$5 4.7,0
SOT23-BEC = smd 1 x 1.4: B -0.95,-1.1; C 0,1.1; E 0.95,-1.1
R1206 = smd 1.6 x 1.803: 1 -1.422,0; 2 1.422,0
0204/5 = drill 0.813 octagon: 1 -2.54,0; 2 2.54,0
R0603 = smd 1 x 1.1: 1 -0.85,0; 2 0.85,0
PEC11R-4215F-S0024 = drill 1 square: 1 -2.5,7 | drill 1: 2 2.5,7; A -2.5,-7.5; B 2.5,-7.5; C 0,-7.5 | drill 1.8 long: P1 -5.7,0; P2 5.7,0
D6R = drill 1.1 pad 1.93: A1 -2.5,2.5; A2 2.5,2.5; B1 -2.5,-2.5; B2 2.5,-2.5
TENNSY41-E = drill 1: 0-RX1/CS1/CRX2 -27.94,-7.62; 1-TX1/MISO1/CTX2 -25.4,-7.62; 2-OUT2 -22.86,-7.62; 3-LRCLK2 -20.32,-7.62; 4-BCLK2 -17.78,-7.62; 5-IN2 -15.24,-7.62; 6-OUT1D -12.7,-7.62; 7-RX2/OUT1A -10.16,-7.62; 8-TX2/IN1 -7.62,-7.62; 9-OUT1C -5.08,-7.62; 10-CS\MQSR -2.54,-7.62; 11-MOSI/CTX1 0,-7.62; 12-MISO/MQSL 2.54,-7.62; 13-SCK/LED 2.54,7.62; 14-A0/TX3/SPDIF_OUT 0,7.62; 15-A1/RX3/SPDIF_IN -2.54,7.62; 16-A2/RX4/SCL1 -5.08,7.62; 17-A3/TX4/SDA1 -7.62,7.62; 18-A4/SDA0 -10.16,7.62; 19-A5/SCL0 -12.7,7.62; 20-A6/TX5/LRCLK1 -15.24,7.62; 21-A7/RX5/BCLK1 -17.78,7.62; 22-A8/CTX1 -20.32,7.62; 23-A9/CRX1/MCLK1 -22.86,7.62; 24-A10/TX6/SCL2 7.62,-7.62; 25-A11/RX6/SDA2 10.16,-7.62; 26-A12/MOSI1 12.7,-7.62; 27-A13/SCK1 15.24,-7.62; 28-RX7 17.78,-7.62; 29-TX7 20.32,-7.62; 30-CRX3 22.86,-7.62; 31-CTX3 25.4,-7.62; 32-OUT1B 27.94,-7.62; 33-MCLK2 27.94,7.62; 34-RX8 25.4,7.62; 35-TX8 22.86,7.62; 36-PWM 20.32,7.62; 37-PWM 17.78,7.62; 38-A14/CS/IN1 15.24,7.62; 39-A15/CS/OUT1A 12.7,7.62; 40-A16/CS1 10.16,7.62; 41-A17/MISO1 7.62,7.62; +5V -24.13,-4.62; DM -21.59,-4.62; DP -19.05,-4.62; GND4 -16.51,-4.62; GND5 -13.97,-4.62; ON/OFF 15.24,5.08; PROGRAM 15.24,2.54; VBAT 15.24,-5.08; VUSB -27.94,5.08 | drill 1 octagon: 3V3-1 5.08,-7.62; 3V3-2 15.24,-2.54; 3V3-3 -25.4,7.62 | drill 1 square: GND1 -30.48,-7.62; GND2 15.24,0; GND3 5.08,7.62; GND6 -27.94,7.62 | drill 1 pad 1.676: VIN -30.48,7.62
DISPLAY-OLED-128X64-I2C = drill 1 square: 1 -3.81,12.7 | drill 1: 2 -1.27,12.7; 3 1.27,12.7; 4 3.81,12.7 | hole 2: -10.414,11.557; 10.414,11.557; 10.414,-11.557; -10.414,-11.557
RK12L12C0A0G = drill 0.8 pad 1.3: A1 0,0; A2 2,0; A3 4,0; B1 -2,0; B2 -4,0; B3 6,0 | drill 2.9 pad 4.35: MH1 -4.5,11; MH2 6.5,11
F25D = smd 1.7 x 3.5: 1 -16.459,-6.045; 2 -13.716,-6.045; 3 -10.973,-6.045; 4 -8.23,-6.045; 5 -5.486,-6.045; 6 -2.743,-6.045; 7 0,-6.045; 8 2.743,-6.045; 9 5.486,-6.045; 10 8.23,-6.045; 11 10.973,-6.045; 12 13.716,-6.045; 13 16.459,-6.045 | smd 1.7 x 3.5 bottom: 14 -15.088,-6.045; 15 -12.344,-6.045; 16 -9.601,-6.045; 17 -6.858,-6.045; 18 -4.115,-6.045; 19 -1.372,-6.045; 20 1.372,-6.045; 21 4.115,-6.045; 22 6.858,-6.045; 23 9.601,-6.045; 24 12.344,-6.045; 25 15.088,-6.045
USB-A003 = smd 1.12 x 4: 1 -3.5,14; 2 -1,14; 3 1,14; 4 3.5,14 | hole 2.3: -6.57,10.28; 6.57,10.28

### Placement (x,y rotation side)
C1  124.46,3.81 180 bottom
C2  134.62,3.81 0 bottom
C3  24.13,38.1 270 bottom
C4  78.74,39.37 180 bottom
C11  15.24,22.86 270 bottom
C12  95.25,26.67 180 bottom
C13  27.94,67.31 0 top
C14  31.75,45.09 180 top
C15  81.28,63.5 180 top
C16  49.53,41.91 270 top
C20  116.84,58.42 270 bottom
C21  113.03,3.81 0 bottom
C101  127,43.18 90 top
C104  106.68,25.4 180 top
C106  77.47,73.66 0 top
C108  43.18,45.72 180 top
C110  127,38.1 90 top
C201  129.54,25.4 90 top
C204  129.54,30.48 90 top
C210  111.76,25.4 180 top
D1  118.11,19.05 0 bottom
D2  104.14,13.97 0 bottom
D3  132.08,19.05 180 bottom
IC1  78.74,83.82 0 bottom
IC2  83.82,30.48 270 bottom
IC3  15.24,72.39 0 bottom
IC4  129.54,27.94 90 bottom
IC6  77.47,69.85 90 bottom
IC7  125.73,55.88 180 bottom
IC8  43.18,41.91 90 bottom
IC9  54.61,83.82 0 bottom
IC10  127,40.64 270 bottom
J1  100.33,60.96 0 top
J2  100.33,58.42 0 top
J_BLUE  31.75,12.7 0 top
J_GREEN  19.05,12.7 0 top
J_RED  6.35,12.7 0 top
JP1  121.92,11.43 180 bottom
JP2  133.86,37.08 90 top
JP4  [1X02']  121.92,49.53 180 top
JP5  [1X02']  129.54,49.53 0 top
L3  76.2,34.29 0 bottom
MOD_A  6.35,35.56 0 top
MOD_B  19.05,35.56 0 top
P1  123.19,19.05 270 bottom
P2  106.68,10.16 180 bottom
P3  127,19.05 270 bottom
P_BLUE  73.66,55.88 180 top
P_GREEN  55.88,55.88 180 top
P_MODA  44.45,76.2 180 top
P_MODB  66.04,76.2 180 top
P_RED  36.83,55.88 180 top
P_SAMPLE  55.88,35.56 180 top
P_X  44.45,97.79 180 top
P_Y  66.04,97.79 180 top
Q1  19.05,25.4 0 bottom
Q2  6.35,25.4 0 bottom
Q3  33.02,24.13 0 bottom
R7  96.52,20.32 180 bottom
R8  24.13,82.55 180 top
R9  33.02,80.01 180 top
R10  24.13,80.01 180 top
R11  19.05,67.31 180 top
R12  24.13,43.18 270 bottom
R13  85.09,69.85 90 top
R14  19.05,64.77 180 top
R16  138.43,41.91 180 bottom
R18  139.7,33.02 0 top
R19  139.7,35.56 0 top
R20  139.7,38.1 0 top
R21  138.43,44.45 0 top
R22  86.36,50.8 90 bottom
R23  112.78,70.48 90 top
R24  138.43,46.99 180 bottom
R25  135.89,57.15 90 bottom
R26  102.87,19.05 180 bottom
R27  110.49,19.05 180 bottom
R28  119.38,34.29 0 bottom
R29  119.38,29.21 180 bottom
R30  119.38,24.13 180 bottom
R31  119.38,26.67 180 bottom
R32  127,34.29 180 bottom
R33  119.38,31.75 180 bottom
R35  138.43,49.53 180 bottom
R36  31.75,39.37 180 top
R37  31.75,41.91 0 top
R38  31.75,36.83 0 top
R39  31.75,34.29 180 top
R40  31.75,29.21 180 top
R41  31.75,31.75 0 top
R42  6.35,20.32 180 bottom
R43  11.43,26.67 180 bottom
R44  19.05,20.32 180 bottom
R45  25.4,26.67 180 bottom
R46  33.02,20.32 180 bottom
R47  25.4,24.13 0 bottom
SW7  129.54,95.25 0 top
SW_BLANK  73.66,12.7 0 top
SW_DOWN  104.14,36.83 0 top
SW_LEFT  93.98,44.45 0 top
SW_PLAY  55.88,12.7 0 top
SW_RECORD  91.44,12.7 0 top
SW_RIGHT  114.3,44.45 0 top
SW_UP  104.14,52.07 0 top
U1  110.49,25.4 0 bottom
U$2  119.38,72.39 180 bottom
U$3  104.14,93.98 0 top
VR1  12.7,87.63 0 top
X1  152.15,33.27 270 top
X2  153.67,88.9 270 bottom
X_IN  6.35,55.88 0 top
Y_IN  19.05,55.88 0 top

### Tracks (layer width: path | path; a pad name or v marks a point on that pad's centre or on a via)
3.3V
  Bottom 0.356: 58.37,47.55 58.37,48.84 P_GREEN.P$1 | 58.37,47.55 58.37,28.57 P_SAMPLE.P$1 | 58.37,47.55 74.68,47.55 75.97,48.84 76.12,48.84 P_BLUE.P$1 75.89,49 75.89,51.13 70.56,56.46 70.56,67.06 68.58,69.04 P_MODB.P$1 68.5,69.27 68.5,72.85 66.6,74.75 66.6,81.46 68.43,83.29 68.43,90.68 P_Y.P$1 68.5,90.83 67.13,92.2 61.72,92.2 60.35,90.83 54.03,90.83 53.87,90.98 52.81,90.98 52.65,90.83 47.02,90.83 P_X.P$1 46.79,90.83 45.49,92.13 40.92,92.13 40.62,91.82 40.62,89.76 41.38,89 41.38,75.51 40.62,74.75 40.62,68.05 43.62,65.04 | 43.62,65.04 46.94,68.35 P_MODA.P$1 | 43.62,65.04 32.99,54.41 32.99,47.85 33.3,47.55 37.87,47.55 39.17,48.84 39.32,48.84 P_RED.P$1
!LDAC
  Bottom 0.152: U$2.22-A8/CTX1 101.12,62.71 110.41,62.71 111.71,61.42 111.71,60.88 119.18,53.42 124.13,53.42 124.82,54.1 124.82,54.71 127.86,57.76 128.63,57.76 IC7.8
+3V3
  Bottom 0.152: 15.24,25.3 15.24,25.45 14.02,26.67 R43.2 | 15.24,25.3 C11.1 | 22.86,24.16 25.38,24.16 27.89,26.67 R45.2 69.42,26.67 77.04,34.29 | 15.24,25.3 21.72,25.3 22.86,24.16 | 22.86,24.16 R47.2 | 77.04,34.29 77.04,39.24 76.96,39.32 C4.+ | IC2.3 81.31,30.48 77.5,34.29 L3.1 77.04,34.29
+3V3_A  (via drill 0.33)
  Top 0.152: C106.1 76.66,73.61 76.66,73.08 v78.26,71.48 78.18,71.48 78.18,69.04 v76.28,67.13 | v44.27,41.91 44.04,42.14 44.04,45.72 C108.1
  Bottom 0.152: v78.26,71.48 78.26,68.81 79.1,67.97 80.01,67.97 IC6.8 | v44.27,41.91 44.27,41 45.26,40.01 IC8.8 45.8,40.01 45.8,38.79 54.56,30.02 54.56,27.66 54.86,27.36 59.44,27.36 66.37,34.29 L3.2 75.51,34.29 75.51,39.4 77.34,41.22 77.34,50.29 76.28,51.36 v76.28,67.13
+5V  (via drill 0.33)
  Top 0.305: R28.1 121.92,34.44 124.66,37.19 124.66,53.8 v124.13,54.33 | v66.6,87.17 80.77,87.17 v82.6,85.34
  Bottom 0.305: R7.2 97.99,20.27 99.06,20.27 100.28,19.05 R26.1 100.43,18.97 104.09,18.97 | C2.+ 136.4,8.76 130.3,14.86 130.3,18.97 D3.C 128.4,19.05 127.02,20.42 P3.1 126.87,20.42 126.04,19.58 123.21,19.58 121.61,17.98 119.1,17.98 118.95,18.14 118.95,18.29 117.12,20.12 115.37,20.12 115.14,19.89 115.14,19.74 113.46,18.06 105,18.06 104.09,18.97 | 123.9,54.33 123.9,54.18 123.67,53.95 122.91,53.95 IC7.1 122.76,53.95 121.92,53.95 121.69,54.18 121.69,54.41 116.89,59.21 C20.1 116.74,59.36 114.45,59.36 110.64,63.17 104.17,63.17 102.72,64.62 102.72,65.91 | 123.9,54.33 123.9,54.56 127.79,58.45 129.54,58.45 129.77,58.22 129.77,57.45 129.54,57.23 128.7,57.23 IC7.9 | 123.9,54.33 v124.13,54.33 | v66.6,87.17 65.84,87.94 65.23,87.94 64.24,86.94 59.06,86.94 IC9.16 | U$3.2 83.21,87.02 IC1.16 83.13,86.87 82.6,86.33 v82.6,85.34 82.68,85.27 82.68,84.2 88.85,78.03 | 88.85,78.03 88.85,64.77 U$2.VIN | 102.72,65.91 102.72,73 98.91,76.81 98.91,78.56 97.69,79.78 97.69,80.47 97,81.15 96.09,81.15 95.1,80.16 95.1,79.55 93.65,78.11 88.92,78.11 88.85,78.03 | 102.72,65.91 98.6,65.91 97.92,65.23 97.92,59.13 96.39,57.61 96.39,52.88 104.17,45.11 104.17,19.05 104.09,18.97
+12V  (via drill 0.33)
  Top 0.305: C104.1 107.59,25.45 v107.59,26.52 111.56,30.48 125.35,30.48 | 126.42,40.92 126.95,41.45 126.95,42.29 C101.1 | 126.42,40.92 125.65,40.16 125.65,37.87 126.26,37.26 126.95,37.26 C110.1 126.95,37.11 126.95,36.35 125.35,34.75 125.35,30.48 | 125.35,30.48 v125.35,28.57 123.21,26.44 v123.21,24.38 | v126.49,40.84 126.42,40.92 | v31.93,24.54 27.89,28.57 27.89,41.83 24.16,45.57 24.16,45.72 R12.1
  Bottom 0.305: v107.59,26.52 107.59,28.96 108.43,29.79 111.25,29.79 112.39,28.65 U1.8 | D1.C 121.77,19.05 123.14,20.42 P1.1 123.21,20.57 123.21,21.34 | v125.35,28.57 125.96,27.96 126.87,27.96 IC4.4 | v126.49,40.84 126.8,40.54 128.09,40.54 128.17,40.62 129.54,40.62 IC10.4 | v123.21,24.38 123.21,21.34 | v31.93,24.54 32.31,24.16 32.69,24.16 33.07,23.77 33.07,21.41 51.89,2.59 121.46,2.59 C1.+ 123.9,2.59 136.86,2.59 137.62,3.35 137.62,8.31 132.89,13.03 132.89,18.29 129.85,21.34 123.21,21.34
-12V  (via drill 0.33)
  Top 0.305: 129.54,27.43 C201.2 | 128.4,28.57 128.25,28.73 128.25,30.79 128.7,31.24 129.46,31.24 129.54,31.32 C204.2 129.46,31.39 129.46,32.23 127.56,34.14 v127.56,35.43 | 128.4,28.57 129.54,27.43 | v129.62,27.51 129.54,27.43 | v102.72,18.21 104.85,20.34 105,20.34 v109.8,25.15 110.03,25.38 110.87,25.38 C210.2 111.02,25.3 111.1,25.22 111.1,24.46 112.7,22.86 122.68,22.86 128.4,28.57
  Bottom 0.305: v129.62,27.51 130,27.89 132.13,27.89 IC4.11 | v127.56,35.43 127.56,38.63 125.58,40.62 124.43,40.62 IC10.11 | v109.8,25.15 109.8,24.69 108.58,23.47 U1.4 | C21.- 111.25,4.19 105.39,10.06 P2.1 105.23,10.21 102.26,13.18 102.26,13.95 D2.A 102.26,14.1 102.72,14.55 v102.72,18.21
AREF_3V3
  Bottom 0.152: 129.35,55.82 129.31,55.85 128.7,55.85 IC7.11 | 129.35,55.82 129.62,55.55 129.62,54.86 129.39,54.63 128.7,54.63 IC7.13 | 129.35,55.82 130.23,56.69 130.23,59.66 125.5,64.39 125.5,79.02 124.51,80.01 U$2.3V3-1
AREF_-10
  Top 0.356: R38.2 34.29,36.73 32.99,35.43 32.99,33.15 33.91,32.23 33.91,32.16 34.29,31.77 R41.2
  Bottom 0.356: MOD_B.P2 17.37,32.38 | 17.37,32.38 MOD_A.P2 6.32,32.54 6.32,33.22 4.65,34.9 4.65,50.98 6.25,52.58 X_IN.P2 6.4,52.73 19.05,52.73 Y_IN.P2 19.13,52.88 19.13,53.57 20.73,55.17 20.73,60.43 16.54,64.62 R14.2 16.46,64.77 15.89,65.34 | R38.2 34.29,36.8 33.38,35.89 28.8,35.89 25.76,38.94 24.31,38.94 C3.1 24.16,39.01 24.16,40.62 R12.2 24,40.69 23.47,41.22 18.52,41.22 17.37,40.08 17.37,32.38 | 15.89,65.34 14.33,66.9 14.33,71.25 IC3.2 | 15.89,65.34 21.56,71.02 21.56,80.01 R10.2
B1+1  (via drill 0.33)
  Top 0.152: v127.86,41.3 128.17,41 128.17,37.57 132.74,32.99 137.16,32.99 R18.1
  Bottom 0.152: 124.43,38.1 124.43,36.88 IC10.8 | v127.86,41.3 126.95,41.3 126.72,41.53 125.81,41.53 125.5,41.22 123.14,41.22 122.99,41.07 122.99,40.23 123.29,39.93 125.58,39.93 125.73,39.78 125.73,38.94 124.89,38.1 124.43,38.1 | 124.43,38.1 IC10.9
B+
  Top 0.152: R18.2 142.26,32.99 145.85,32.99 146.07,33.22 X1.7
ENC_A
  Bottom 0.152: U$2.40-A16/CS1 128.55,63.78 126.57,63.78 125.96,64.39 125.96,80.39 127.02,81.46 127.02,87.71 SW7.A
ENC_B
  Bottom 0.152: U$2.41-A17/MISO1 127.02,64.77 127.02,76.05 131.06,80.09 131.06,86.79 131.98,87.71 SW7.B
G1+
  Bottom 0.152: IC10.6 129.62,38.1 129.62,36.88 IC10.7 129.69,36.88 130.99,35.59 137.16,35.59 R19.1
G+
  Top 0.152: R19.2 142.26,35.59 145.69,35.59 146.07,35.97 X1.6
GND  (via drill 0.33)
  Bottom 0.152: X1.18 146.15,37.34 146.15,34.67 X1.19 146.15,34.59 146.15,31.93 X1.20 146.07,31.85 145.85,31.85 144.09,30.1 144.09,19.05 | 144.09,19.05 145.24,19.05 X1.25 | 144.09,19.05 v139.68,19.05 D3.A | 74.91,80.77 75.51,80.77 IC1.7 | 74.91,80.77 74.3,80.77 IC1.8 | IC6.3 74.91,70.48 74.91,71.7 IC6.4 74.91,71.78 v74.91,76.28 74.91,80.77 | 15.24,22.02 15.85,22.02 18.06,24.23 Q1.E | 40.62,43.81 40.62,42.6 IC8.3 | IC9.7 51.44,80.77 50.22,80.77 IC9.8 50.22,80.85 50.22,82.53 41.99,90.75 P_X.P$3 | v15.32,71.32 16.15,71.32 IC3.1 | C3.2 24.08,37.19 24.08,34.9 19.05,29.87 MOD_B.P1 | v115.82,57.61 116.82,57.61 C20.2 | 5.41,25.3 5.41,28.88 6.32,29.79 MOD_A.P1 | 5.41,25.3 Q2.E | Q3.E 32.08,23.01 32.08,18.44 33.38,17.14 33.38,11.12 31.77,9.53 J_BLUE.P2 | 114.34,13.91 115.52,12.72 JP1.3 | 114.34,13.91 114.3,13.95 106.07,13.95 D2.C | 114.34,13.91 116.2,15.77 D1.A | SW_LEFT.B1 88.62,39.09 IC2.1 | IC8.5 47.7,43.81 52.73,48.84 53.34,48.84 P_GREEN.P$3 | v125.27,26.67 IC4.3 | v80.09,72.62 80.09,71.78 IC6.5 | v133.81,29.18 132.21,29.18 IC4.10 | v122.76,41.91 IC10.12 | v40.62,44.65 40.62,43.81 | 40.62,43.81 IC8.4 | 15.24,22.02 11.12,22.02 7.85,25.3 5.41,25.3 | 15.24,22.02 C11.2
  pour Top: 1.27,107.95 143.51,107.95 144.78,106.68 144.78,1.27 2.54,1.27 1.27,0
INH1  (via drill 0.33)
  Top 0.152: v62.03,91.52 61.87,91.67 61.87,91.97 v64.47,94.56
  Bottom 0.152: v62.03,91.52 60.88,90.37 57,90.37 54.64,88.01 54.64,85.88 52.73,83.97 52.73,80.77 IC9.6 | v64.47,94.56 80.62,94.56 94.41,108.36 127.79,108.36 145.01,91.14 145.01,80.24 U$2.31-CTX3
INH2  (via drill 0.33)
  Top 0.152: v77.5,82.68 79.17,82.68 81.15,84.66 101.35,84.66 101.96,85.27 v116.13,85.27
  Bottom 0.152: v77.5,82.68 76.89,82.07 76.89,80.77 IC1.6 | v116.13,85.27 123.14,85.27 126.64,88.77 132.44,88.77 137.16,84.05 U$2.28-RX7
INTERLOCK
  Top 0.152: JP2.3 135.33,39.62 136.47,40.77 143.87,40.77 144.55,41.45 146.07,41.45 X1.4
INTERLOCK2
  Bottom 0.152: JP2.2 133.88,37.11 142.88,37.11 145.85,40.08 146.07,40.08 X1.17
MOD_A  (via drill 0.33)
  Top 0.152: v105.16,63.93 104.01,62.79 87.86,62.79 79.1,54.03 v55.17,54.03
  Bottom 0.152: IC8.1 41.07,40.01 41.91,40.84 41.91,41.68 41.87,41.72 | 41.87,41.72 41.61,41.99 38.63,41.99 34.67,45.95 30.1,45.95 29.26,45.11 C14.2 29.26,45.03 29.26,41.91 R37.1 | U$2.14-A0/TX3/SPDIF_OUT 118.26,64.77 117.27,63.78 105.31,63.78 v105.16,63.93 | v55.17,54.03 54.18,54.03 41.87,41.72
MOD_B
  Top 0.152: R40.1 34.29,29.18 38.41,29.18 48.62,39.4 49.53,39.4 C16.2 49.53,39.32 50.37,40.16 70.1,40.16 92.43,62.48 114.22,62.48 116.51,64.77 U$2.15-A1/RX3/SPDIF_IN
  Bottom 0.152: IC8.7 45.8,41.22 47.7,41.22 49.53,39.4 C16.2
MOSI
  Bottom 0.152: IC7.5 122.83,56.54 123.44,56.54 123.83,56.92 123.83,63.55 122.91,64.47 122.91,76.5 119.4,80.01 U$2.11-MOSI/CTX1
MUXA  (via drill 0.33)
  Top 0.152: v57.3,91.9 v55.55,90.14 | v75.82,88.7 v77.34,90.22
  Bottom 0.152: v55.55,90.14 52.73,87.33 52.73,86.94 IC9.11 | v57.3,91.9 60.35,91.9 61.42,92.96 71.17,92.96 75.63,88.51 | 75.63,88.51 76.81,87.33 76.81,86.94 IC1.11 | v77.34,90.22 80.54,90.22 98.37,108.05 127.64,108.05 141.96,93.73 141.96,84.73 139.75,82.53 139.75,80.01 U$2.29-TX7 | 75.63,88.51 v75.82,88.7
MUXB  (via drill 0.33)
  Top 0.152: v56.01,91.9 v54.25,90.14 | U$2.34-RX8 145.77,64.77 146.38,65.38 146.38,79.55 145.77,80.16 145.77,106.15 143.64,108.28 87.4,108.28 v72.47,93.34
  Bottom 0.152: IC9.10 51.44,87.33 v54.25,90.14 | v56.01,91.9 56.46,91.9 57.84,93.27 72.16,93.27 72.28,93.15 | 72.28,93.15 77.42,88.01 77.42,85.8 77.27,85.65 76.35,85.65 75.59,86.41 75.59,86.87 IC1.10 | 72.28,93.15 v72.47,93.34
MUXC  (via drill 0.33)
  Top 0.152: v54.33,91.52 v53.11,90.3 | v70.64,92.35 v73.46,95.17
  Bottom 0.152: v53.11,90.3 50.22,87.4 50.22,86.94 IC9.9 | v54.33,91.52 55.55,91.52 55.78,91.29 60.2,91.29 61.57,92.66 68.89,92.66 69.91,91.63 | 69.91,91.63 74.3,87.25 IC1.9 | v73.46,95.17 86.94,108.66 132.51,108.66 145.77,95.4 145.77,79.55 142.26,76.05 142.26,64.77 U$2.35-TX8 | 69.91,91.63 v70.64,92.35
MUXOUT1  (via drill 0.33)
  Top 0.152: v66.67,88.09 118.64,88.09 126.72,80.01 U$2.24-A10/TX6/SCL2
  Bottom 0.152: v66.67,88.09 66.37,88.39 57.61,88.39 57.23,88.01 57.23,85.88 56.54,85.19 56.54,80.77 IC9.3
MUXOUT2  (via drill 0.33)
  Top 0.152: v88.09,77.8 92.58,77.8 94.72,75.67 124.89,75.67 129.24,80.01 U$2.25-A11/RX6/SDA2
  Bottom 0.152: v88.09,77.8 83.9,81.99 81.46,81.99 80.7,81.23 80.7,80.77 IC1.3
N$1
  Bottom 0.152: IC7.14 128.7,53.87 128.7,51.59 130.76,49.53 JP5.2
N$3  (via drill 0.33)
  Top 0.152: v106.6,84.66 101.8,84.66 97.77,80.62 97.77,79.25 95.56,77.04 95.25,77.04 U$2.+5V
  Bottom 0.152: v106.6,84.66 113.31,84.66 120.93,92.28 139.52,92.28 139.6,92.35 X2.1
N$4  (via drill 0.33)
  Top 0.152: v105.99,84.05 103.78,84.05 100.36,80.62 100.36,79.32 98.07,77.04 97.84,77.04 U$2.DM
  Bottom 0.152: v105.99,84.05 113.16,84.05 118.95,89.84 139.6,89.84 X2.2
N$5  (via drill 0.33)
  Top 0.152: v105.54,83.29 102.87,80.62 102.87,80.39 102.79,80.31 102.79,79.78 102.87,79.7 102.87,79.4 100.51,77.04 100.36,77.04 U$2.DP
  Bottom 0.152: v105.54,83.29 112.85,83.29 118.95,89.38 137.24,89.38 138.68,87.94 139.6,87.94 X2.3
N$6  (via drill 0.33)
  Top 0.152: v80.85,63.78 82.6,63.78 82.91,63.48 83.82,63.48 C15.1 | R9.2 33.91,80.01 35.05,81.15 62.41,81.15 v67.28,76.28
  Bottom 0.152: R8.1 R10.1 R9.2 | v80.85,63.78 80.85,63.86 75.51,69.19 74.91,69.19 IC6.2 74.83,69.27 74.3,69.27 v67.28,76.28
N$7
  Bottom 0.152: P2.2 108.13,10.21 113.01,10.21 JP1.2 113.01,10.29 113.01,12.65 JP1.1
N$8
  Bottom 0.152: P1.2 123.21,17.6 123.21,12.72 JP1.9 123.21,12.65 123.21,10.21 JP1.10
N$9
  Bottom 0.152: VR1.B2 8.69,87.63 8.69,62.64 6.4,60.35 X_IN.P3
N$10
  Bottom 0.152: P3.2 126.95,17.6 126.95,13.95 125.73,12.72 JP1.11 JP1.12
N$11  (via drill 0.33)
  Top 0.152: v81.38,75.59 81.84,75.59 85.04,72.39 R13.2
  Bottom 0.152: R14.1 21.64,64.77 21.64,67.28 R11.1 21.72,67.28 25.38,67.28 C13.1 25.45,67.36 25.45,73.76 40.16,88.47 40.16,91.97 42.14,93.95 72.77,93.95 78.79,87.94 78.79,78.18 v81.38,75.59 | IC6.6 81.76,70.48 83.67,72.39 R13.2
N$12  (via drill 0.33)
  Top 0.152: v108.43,78.33 104.47,78.33 103.17,77.04 102.87,77.04 U$2.GND4
  Bottom 0.152: v108.43,78.33 108.97,78.33 110.72,80.09 110.72,80.7 119.1,89.08 135.56,89.08 139.22,85.42 139.6,85.42 X2.4
N$13
  Bottom 0.152: IC10.13 124.43,43.2 124.43,44.42 IC10.14
N$14
  Bottom 0.152: R38.1 29.26,36.88 31.85,36.88 34.29,39.32 R36.1 34.29,40.77 34.86,41.34 | 34.86,41.34 R37.2 C14.1 | 34.86,41.34 34.9,41.3 40.54,41.3 IC8.2
N$15
  Bottom 0.152: R8.2 21.56,82.6 21.56,84.81 18.74,87.63 VR1.B3
N$16
  Bottom 0.152: IC2.2 91.9,28.19 93.42,26.67 C12.+ 93.5,26.67 95.1,25.07 95.1,20.34 R7.1
N$17
  Bottom 0.152: IC7.10 128.63,56.46 127.94,56.46 123.21,51.74 123.21,49.53 JP4.1
N$19  (via drill 0.33)
  Top 0.152: v79.63,82.3 79.63,73.91 81.08,72.47 81.08,72.39 v83.21,70.26
  Bottom 0.152: v79.63,82.3 80.62,83.29 80.62,86.87 IC1.14 | v83.21,70.26 83.36,70.26 86.87,66.75 86.87,58.29 97.69,47.47 97.69,38.94 87.55,28.8 87.55,21.57 93.88,15.24 SW_RECORD.A2
N$20
  Bottom 0.152: IC1.15 81.92,83.74 80.09,81.92 80.09,78.18 82.3,75.97 82.3,72.24 81.08,71.02 78.87,71.02 78.72,70.87 78.72,68.81 79.02,68.5 81.31,68.5 81.76,68.05 81.76,40.08 84.96,36.88 84.96,24 SW_BLANK.A2
N$21
  Bottom 0.152: IC1.12 78.11,82.45 77.42,81.76 77.42,71.93 77.34,71.86 77.34,68.12 81.46,64.01 81.46,39.93 84.66,36.73 84.66,27.66 73.46,16.46 59.67,16.46 58.45,15.24 SW_PLAY.A2
N$22
  Bottom 0.152: IC9.13 55.25,82.45 54.56,81.76 54.56,66.6 36.88,48.92 P_RED.P$2
N$23  (via drill 0.33)
  Top 0.152: v97.61,57.84 v96.62,58.83
  Bottom 0.152: v96.62,58.83 93.19,58.83 87.78,64.24 87.78,65.3 88.39,65.91 88.39,71.25 83.21,76.43 83.21,80.7 IC1.1 | v97.61,57.84 99.21,57.84 100.51,56.54 107.21,56.54 116.74,47.02 SW_RIGHT.A2
N$24
  Bottom 0.152: IC9.14 56.54,86.94 56.54,87.78 57.45,88.7 66.9,88.7 67.28,88.32 67.28,82.75 66.14,81.61 66.14,71.32 67.36,70.1 67.36,55.17 73.61,48.92 P_BLUE.P$2
N$25
  Bottom 0.152: VR1.A2 14.63,87.63 14.63,72.85 13.64,71.86 13.64,65.76 19.05,60.35 Y_IN.P3
N$26  (via drill 0.33)
  Top 0.152: v82.37,65.3 v81.15,66.52
  Bottom 0.152: IC1.5 78.11,72.16 77.65,71.7 77.65,68.58 79.7,66.52 v81.15,66.52 | v82.37,65.3 82.37,61.11 96.47,47.02 SW_LEFT.A2
N$27
  Bottom 0.152: IC9.15 57.76,86.87 57.76,82.45 57.07,81.76 57.07,50.06 55.93,48.92 P_GREEN.P$2
N$28  (via drill 0.33)
  Top 0.152: v103.4,42.22 106.22,39.4 106.6,39.4 SW_DOWN.A2
  Bottom 0.152: IC1.2 81.92,77.27 88.09,71.09 88.09,66.06 87.48,65.46 87.48,63.78 95.94,55.32 95.94,49.68 v103.4,42.22
N$29
  Bottom 0.152: IC9.12 53.95,86.87 53.95,86.41 53.19,85.65 49.61,85.65 44.5,90.75 P_X.P$2
N$30
  Bottom 0.152: U1.2 111.1,22.78 111.1,22.17 107.98,19.05 R27.1 R26.2
N$31
  Bottom 0.152: U1.6 109.88,27.96 109.88,26.98 111.33,25.53 113.16,25.53 R29.1 117.73,30.1 117.73,32.08 116.89,32.92 116.89,34.29 R28.2
N$32  (via drill 0.33)
  Top 0.152: v65.46,87.17 65.46,90.22 65.99,90.75 P_Y.P$2
  Bottom 0.152: v65.46,87.17 59.06,80.77 IC9.1
N$33  (via drill 0.33)
  Top 0.152: v83.21,71.09 v81.69,72.62 | v97.16,55.09 v95.33,55.09
  Bottom 0.152: v81.69,72.62 81.99,72.92 81.99,75.82 79.4,78.41 79.4,80.7 IC1.4 | v83.21,71.09 87.17,67.13 87.17,63.25 v95.33,55.09 | v97.16,55.09 100.43,55.09 101.12,55.78 105.46,55.78 106.6,54.63 SW_UP.A2
N$34
  Bottom 0.152: C16.1 49.53,44.42 47.7,42.6 45.8,42.6 IC8.6 45.72,42.52 44.04,42.52 41.91,40.39 41.91,39.55 36.65,34.29 R39.1 31.77,34.29 29.26,31.77 R41.1 29.26,31.7 29.26,29.26 R40.2
N$35
  Bottom 0.152: R33.2 121.92,31.77 124.43,34.29 R32.1 126.19,34.29 130,30.48 IC4.9
N$36
  Bottom 0.152: IC4.2 126.87,25.45 123.14,25.45 R31.2 121.92,26.59 119.48,24.16 116.89,24.16 R30.1
N$39
  Bottom 0.152: IC1.13 79.4,86.94 79.4,87.63 99.52,107.75 126.49,107.75 131.98,102.26 SW7.2
N$40
  Bottom 0.152: IC9.5 53.95,80.7 53.95,78.72 44.5,69.27 P_MODA.P$2
N$41
  Bottom 0.152: IC9.2 57.84,80.7 57.84,77.42 65.99,69.27 P_MODB.P$2
N$42
  Bottom 0.152: IC9.4 55.25,54.79 55.78,54.25 55.78,51.05 54.71,49.99 54.71,30.33 55.86,29.18 55.86,28.57 P_SAMPLE.P$2
N$43
  Bottom 0.152: R11.2 16.54,67.36 16.54,70.41 16.84,70.71 16.84,87.55 16.76,87.63 VR1.A3
N$44
  Bottom 0.152: R42.1 3.81,19.66 6.32,17.14 J_RED.P3
N$45
  Bottom 0.152: R36.2 29.19,39.4 26.59,39.4 24.31,41.68 8.08,41.68 6.4,40.01 MOD_A.P3
N$46
  Bottom 0.152: R39.2 28.5,34.29 24.69,38.1 20.95,38.1 MOD_B.P3
N$48
  Bottom 0.152: R44.2 20.04,21.87 20.04,24.23 Q1.B
N$49
  Bottom 0.152: J_GREEN.P3 16.54,19.66 16.54,20.27 R44.1
N$51
  Bottom 0.152: Q3.B 33.98,23.01 33.98,21.87 35.51,20.34 R46.2
N$52
  Bottom 0.152: R46.1 30.48,18.36 31.7,17.14 J_BLUE.P3
N$66
  Bottom 0.152: Q2.B 7.32,24.23 7.32,21.87 8.84,20.34 R42.2
OUTL  (via drill 0.33)
  Top 0.152: v103.56,55.17 103.94,55.17 108.2,59.44 108.66,59.44 110.18,60.96 J1.5
  Bottom 0.152: v103.56,55.17 104.62,54.1 104.62,28.57 107.37,25.83 110.03,25.83 110.49,25.38 110.49,24.69 109.88,24.08 109.88,22.86 U1.3 | JP5.1 125.42,49.53 123.67,47.78 122.76,47.78 121.69,48.84 121.69,50.67 119.25,53.11 118.34,53.11 J1.5
OUTR
  Bottom 0.152: U1.5 108.58,28.5 109.42,29.34 110.26,29.34 110.57,29.03 110.57,26.75 111.48,25.83 112.09,25.83 113.01,26.75 113.01,35.89 111.56,37.34 111.56,38.86 117.65,44.96 117.88,44.96 120.63,47.7 120.63,49.53 | J1.3 106.22,60.96 117.65,49.53 120.63,49.53 | 120.63,49.53 JP4.2
R1+
  Bottom 0.152: IC10.1 129.62,44.42 129.62,43.2 IC10.2 129.69,43.2 132.59,43.2 137.16,38.63 R20.1
R+
  Top 0.152: R20.2 143.94,38.1 144.55,38.71 146.07,38.71 X1.5
SCK
  Bottom 0.152: U$2.13-SCK/LED 121.84,64.69 121.84,56.16 122.07,55.93 122.76,55.93 IC7.4
SCL
  Bottom 0.152: U$2.19-A5/SCL0 106.68,77.19 105.69,78.18 105.69,79.86 104.62,80.92 104.62,83.97 105.39,84.73 105.39,106.68 U$3.3
SDA
  Bottom 0.152: U$3.4 107.9,106.68 107.9,86.79 104.93,83.82 104.93,83.06 106.98,81 107.14,81 107.82,80.31 107.82,66.14 109.2,64.77 U$2.18-A4/SDA0
SHUTTER  (via drill 0.33)
  Top 0.152: U$2.30-CRX3 142.57,80.01 145.77,76.81 v145.77,65.61 | v139.22,37.72 139.22,22.33 144.7,16.84 146.07,16.84 X1.13
  Bottom 0.152: v145.77,65.61 145.77,64.31 144.17,62.71 139.52,62.71 139.22,62.41 v139.22,37.72
SS
  Bottom 0.152: IC7.3 122.76,55.24 122.15,55.24 120.78,56.62 120.78,76.12 116.89,80.01 U$2.10-CS\MQSR
T26  (via drill 0.33)
  Top 0.152: v53.57,30.18 60.58,30.18 81.92,51.51 100.74,51.51 105.31,56.08 110.03,56.08 118.11,64.16 118.11,64.39 118.03,64.47 118.03,65 118.11,65.08 118.11,65.76 132.06,79.7 132.06,80.01 U$2.26-A12/MOSI1
  Bottom 0.152: Q2.C 6.4,26.52 8.69,26.52 8.84,26.67 R43.1 8.91,26.67 10.06,27.81 29.03,27.81 31.39,30.18 v53.57,30.18
T27  (via drill 0.33)
  Top 0.152: v75.29,33.38 80.09,33.38 97.92,51.21 107.67,51.21 120.63,64.16 120.63,65.76 134.57,79.7 134.57,80.01 U$2.27-A13/SCK1
  Bottom 0.152: Q1.C 19.05,26.52 22.71,26.52 R45.1 23.7,27.51 28.35,27.51 28.8,27.05 59.59,27.05 65.91,33.38 v75.29,33.38
T38  (via drill 0.33)
  Top 0.152: v103.4,28.8 v112.17,37.57
  Bottom 0.152: R47.1 29.03,25.22 32.99,25.22 Q3.C 33.07,25.22 33.38,25.22 44.65,13.95 94.41,13.95 96.16,15.7 96.16,20.65 103.4,27.89 v103.4,28.8 | v112.17,37.57 112.17,39.01 116.36,43.2 116.59,43.2 120.85,47.47 123.83,47.47 124.13,47.78 131.29,47.78 134.57,51.05 134.57,64.77 U$2.38-A14/CS/IN1
TB  (via drill 0.33, 0.35)
  Top 0.152: v117.65,45.57 v120.02,43.2 | v97.16,56.54 v94.03,59.66 92.69,59.66 R22.2
  Bottom 0.152: v120.02,43.2 120.02,42.75 123.37,39.4 124.36,39.4 IC10.10 | v117.65,45.57 116.43,45.57 107.9,54.1 107.9,55.02 106.68,56.24 97.46,56.24 v97.16,56.54 | U$2.2-OUT2 96.47,80.01 96.47,66.14 95.02,64.69 95.02,60.73 93.98,59.69 94,59.66 v94.03,59.66
TG  (via drill 0.33)
  Top 0.152: v131.14,42.6 131.14,43.66 125.12,49.68 125.12,54.25 v120.17,59.21
  Bottom 0.152: v131.14,42.6 131.14,40.31 130.23,39.4 129.62,39.4 IC10.5 | v120.17,59.21 120.17,64.16 120.4,64.39 120.4,65.38 112.78,73 R23.2 112.78,73.08 114.3,74.6 U$2.9-OUT1C
TR
  Bottom 0.152: IC10.3 129.08,41.91 128.25,42.75 128.25,44.88 130.83,47.47 131.44,47.47 135.03,51.05 135.03,58.83 R25.2 139.22,63.02 141.88,63.02 143.26,64.39 143.26,64.69 147.3,68.73 147.3,80.01 U$2.32-OUT1B
X1+  (via drill 0.33)
  Top 0.152: R35.1 133.5,49.53 131.14,47.17 v129.69,47.17
  Bottom 0.152: 126.95,30.86 126.95,31.7 IC4.7 | 126.95,30.86 IC4.6 | v129.69,47.17 122.68,47.17 119.1,43.59 119.1,33.38 121.61,30.86 126.95,30.86
X1-  (via drill 0.33)
  Top 0.152: v129.08,46.56 130.99,46.56 131.44,47.02 135.87,47.02 R24.1
  Bottom 0.152: IC4.8 132.13,31.77 129.62,34.29 R32.2 127.79,34.29 126.95,35.13 124.36,35.13 119.4,40.08 119.4,43.43 122.53,46.56 v129.08,46.56
X2
  Bottom 0.152: R27.2 113.01,19.05 112.39,19.66 U1.1 112.39,23.55 120.43,31.59 | 120.43,31.59 117.73,34.29 117.73,34.59 117.2,35.13 116.43,35.13 115.98,34.67 115.98,32.61 R33.1 | 120.43,31.59 121.46,30.56 121.77,30.56 123.06,29.26 126.87,29.26 IC4.5
X+
  Top 0.152: R35.2 145.92,49.53 146.07,49.68 X1.1
X-
  Bottom 0.152: R24.2 140.97,47.02 144.78,47.02 146.07,48.31 X1.14
X_IN  (via drill 0.33)
  Top 0.152: R9.1 62.33,80.01 v67.28,75.06 | U$2.17-A3/TX4/SDA1 111.48,64.77 110.87,65.38 110.72,65.38 109.96,66.14 91.97,66.14 91.9,66.06 91.82,66.06 91.75,65.99 91.14,65.99 91.06,66.06 89.53,66.06 89.38,66.22 85.65,66.22 84.12,64.69 79.93,64.69 C15.2
  Bottom 0.152: C15.2 78.72,63.55 78.72,65.53 76.35,67.89 74.91,67.89 IC6.1 74.83,67.97 74.37,67.97 v67.28,75.06
Y1+  (via drill 0.33)
  Top 0.152: R21.1 131.75,40.31 v131.75,34.98
  Bottom 0.152: IC4.14 132.13,24.16 132.13,25.38 IC4.13 132.21,25.45 133.12,25.45 134.72,27.05 134.72,31.39 131.75,34.37 v131.75,34.98
Y1-  (via drill 0.33)
  Top 0.152: R16.1 134.87,41.91 v133.96,41
  Bottom 0.152: R30.2 121.92,24.16 122.83,25.07 123.44,25.07 124.36,24.16 126.87,24.16 IC4.1 126.95,24.16 127.48,24.16 129.31,25.98 133.2,25.98 134.42,27.2 134.42,31.24 133.35,32.31 132.36,32.31 128.25,36.42 128.25,38.48 128.4,38.63 130.61,38.63 132.97,41 v133.96,41
Y2  (via drill 0.33)
  Top 0.152: v111.71,26.44 111.94,26.67 R31.1
  Bottom 0.152: v111.71,26.44 111.18,26.98 111.18,27.96 U1.7 | IC4.12 128.7,26.67 128.02,27.36 123.75,27.36 121.92,29.18 R29.2 121.92,29.11 119.48,26.67 R31.1
Y+
  Top 0.152: R21.2 140.97,44.42 142.04,44.42 144.55,46.94 146.07,46.94 X1.2
Y-
  Bottom 0.152: R16.2 142.19,41.91 145.85,45.57 146.07,45.57 X1.15
Y_IN
  Top 0.152: C13.2 30.48,67.28 75.29,67.28 76.05,66.52 80.31,66.52 81.08,67.28 85.04,67.28 R13.1 85.11,67.36 86.41,68.66 110.26,68.66 114.15,64.77 U$2.16-A2/RX4/SCL1
  Bottom 0.152: R13.1 83.21,69.19 80.09,69.19 IC6.7

### Text on the board
tNames: -12V
bNames: -12V
TallParts: ISP
ArduinoHoles: 3.2mm | 2.2mm | 3.2mm